# Altium project ShouHuoGui.PrjPCB
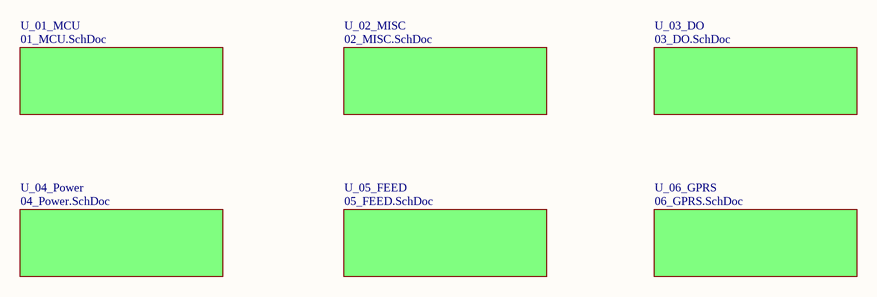
[diagram p0: WRSHG_V1.1.SchDoc]
7 sheets, 395 parts. Net scope: global (net labels, ports and power ports of the same name join across sheets).
Board file: ZhuKong.PcbDoc
Sheets:
  WRSHG_V1.1.SchDoc
    U_01_MCU = 01_MCU.SchDoc
    U_02_MISC = 02_MISC.SchDoc
    U_03_DO = 03_DO.SchDoc
    U_04_Power = 04_Power.SchDoc
    U_05_FEED = 05_FEED.SchDoc
    U_06_GPRS = 06_GPRS.SchDoc

## Sheet WRSHG_V1.1.SchDoc
size A4

### Sub-sheets
U_01_MCU = 01_MCU.SchDoc: no entries
U_02_MISC = 02_MISC.SchDoc: no entries
U_03_DO = 03_DO.SchDoc: no entries
U_04_Power = 04_Power.SchDoc: no entries
U_05_FEED = 05_FEED.SchDoc: no entries
U_06_GPRS = 06_GPRS.SchDoc: no entries

## Sheet 01_MCU.SchDoc
size A3
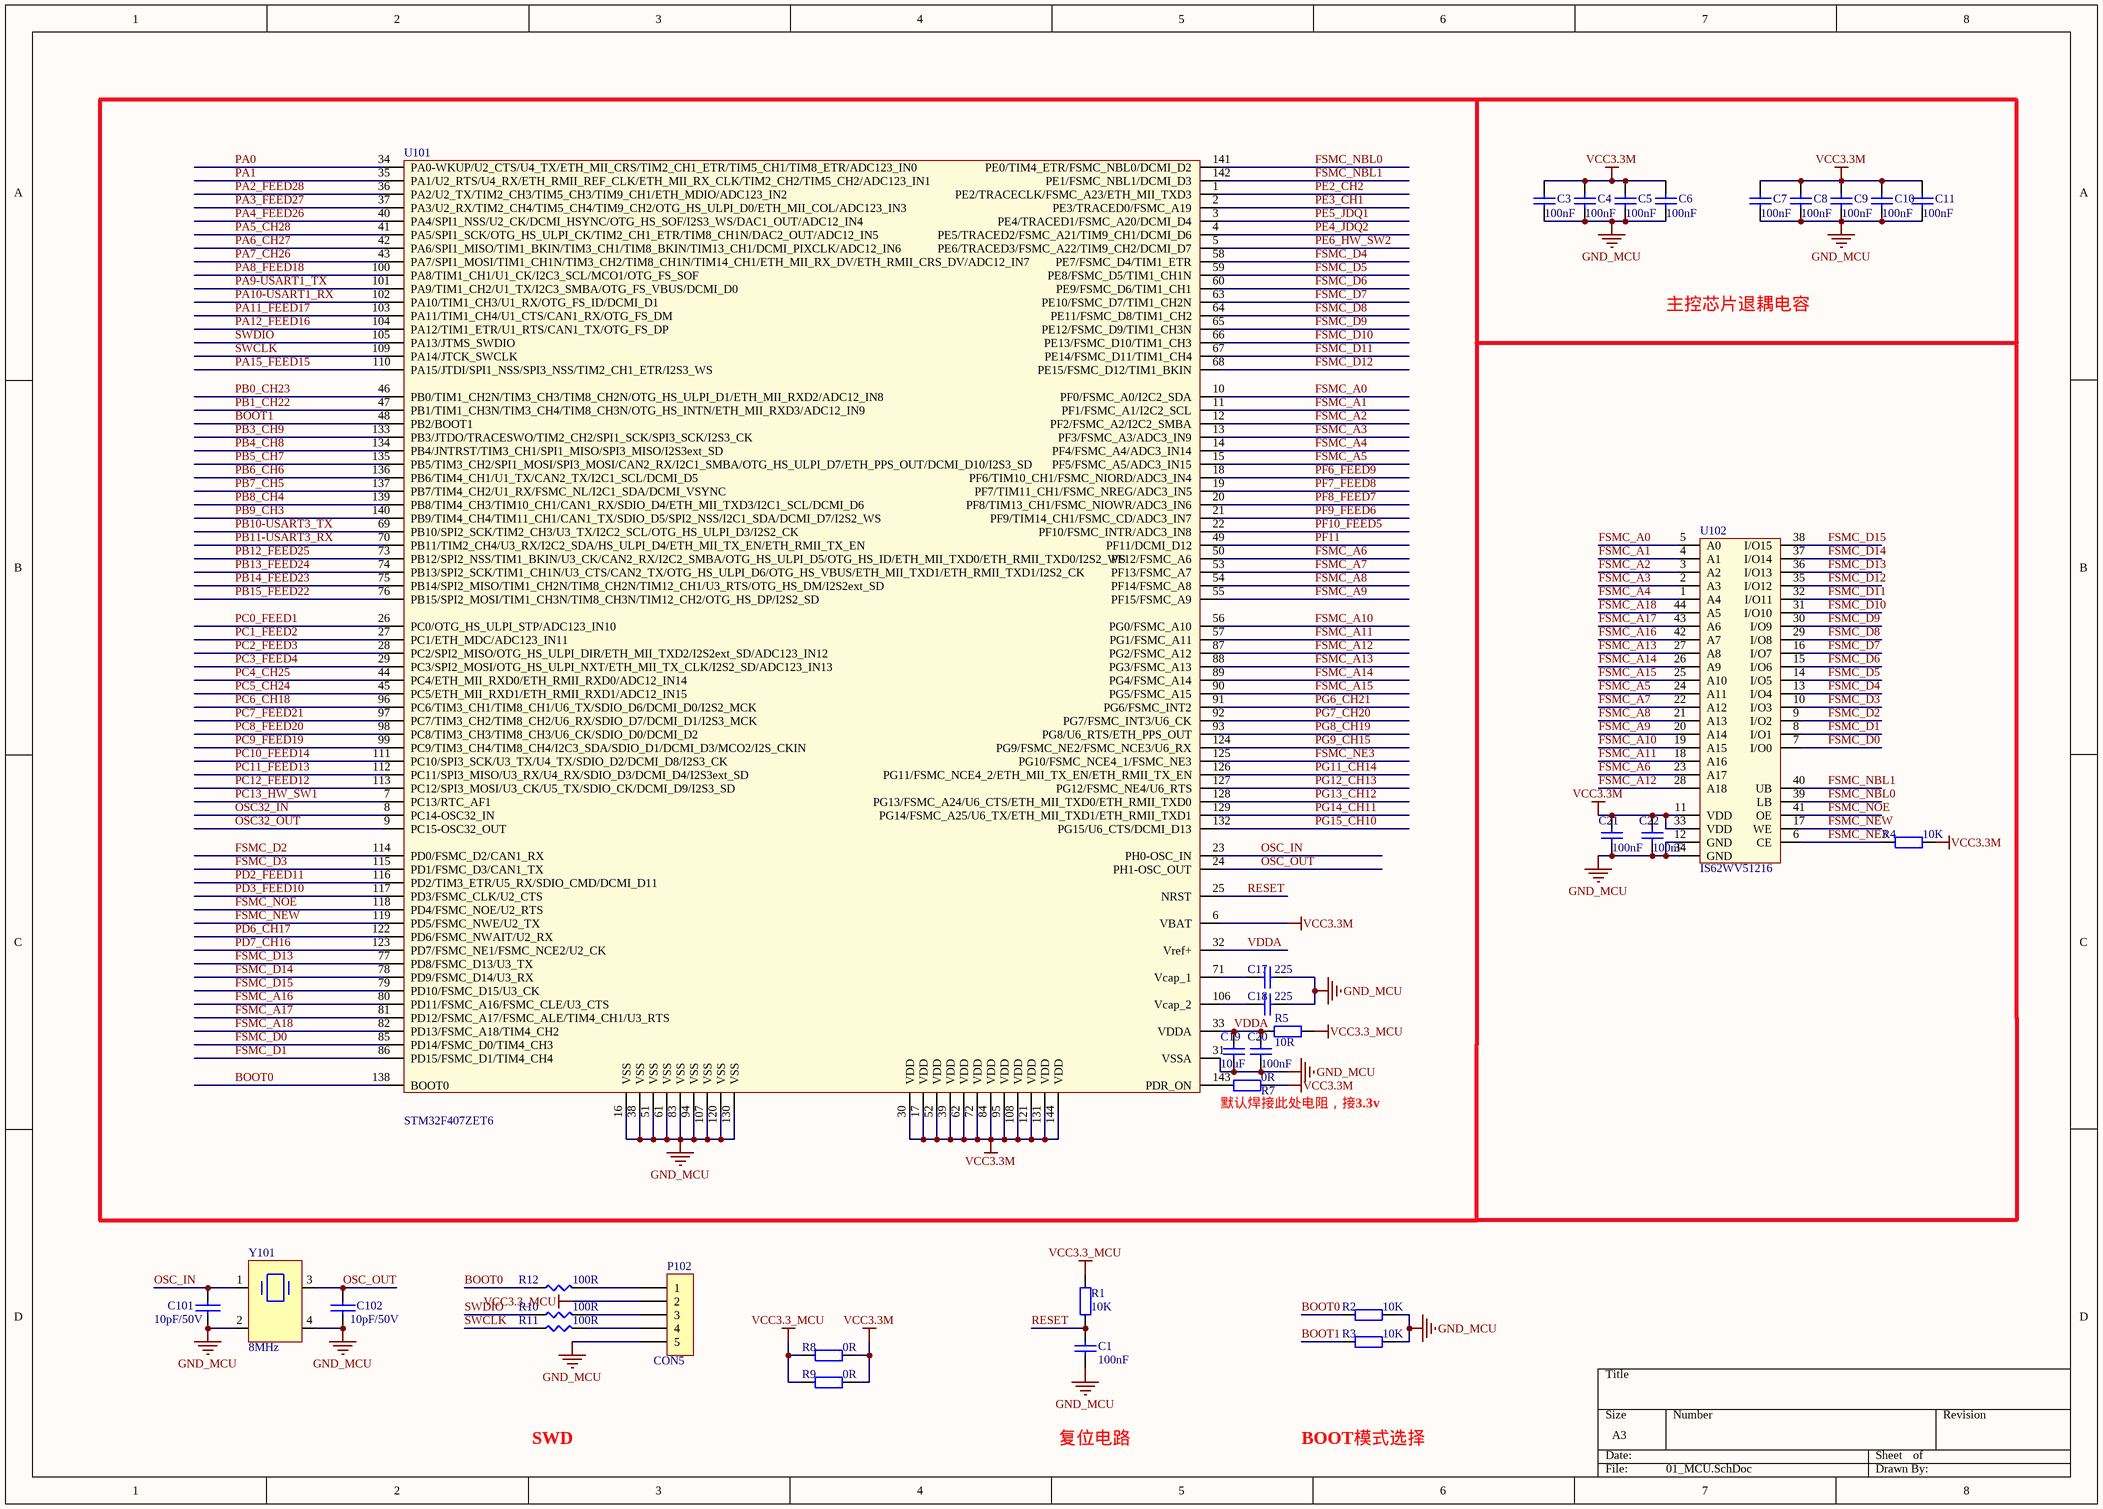
[diagram p1: 01_MCU.SchDoc]

### Parts
C1  100nF  [0603C]
C3  100nF  [0603C]
C4  100nF  [0603C]
C5  100nF  [0603C]
C6  100nF  [0603C]
C7  100nF  [0603C]
C8  100nF  [0603C]
C9  100nF  [0603C]
C10  100nF  [0603C]
C11  100nF  [0603C]
C17  225  [0603C]
C18  225  [0603C]
C19  10uF  [0603C]
C20  100nF  [0603C]
C21  100nF  [LC-0603_R]
C22  100nF  [LC-0603_R]
C101  10pF/50V  [0603C]
C102  10pF/50V  [0603C]
P102  CON5  [SIP5]
R1  10K  [0603R]
R2  10K  [0603R]
R3  10K  [0603R]
R4  10K  [0603R]
R5  10R  [0603R]
R7  0R  [0603R]
R8  0R  [0805R]
R9  0R  [0805R]
R10  100R  [0603R]
R11  100R  [0603R]
R12  100R  [0603R]
U101  STM32F407ZET6  [TQFP144]
U102  IS62WV51216  [TSOP44]
Y101  8MHz  [X_TXCWY]

### Nets
GND_MCU: C1.1 C3.2 C4.2 C5.2 C6.2 C7.2 C8.2 C9.2 C10.2 C11.2 C17.1 C18.1 C19.2 C20.2 C21.2 C22.2 C101.1 C102.1 P102.5 R2.2 R3.2 U101.16(VSS) U101.31(VSSA) U101.38(VSS) U101.51(VSS) U101.61(VSS) U101.83(VSS) U101.94(VSS) U101.107(VSS) U101.120(VSS) U101.130(VSS) U102.12(GND) U102.34(GND) Y101.2 Y101.4
VCC3.3_MCU: P102.2 R1.2 R5.2 R8.1 R9.1
VCC3.3M: C3.1 C4.1 C5.1 C6.1 C7.1 C8.1 C9.1 C10.1 C11.1 C21.1 C22.1 R4.2 R7.2 R8.2 R9.2 U101.6(VBAT) U101.17(VDD) U101.30(VDD) U101.39(VDD) U101.52(VDD) U101.62(VDD) U101.72(VDD) U101.84(VDD) U101.95(VDD) U101.108(VDD) U101.121(VDD) U101.131(VDD) U101.144(VDD) U102.11(VDD) U102.33(VDD)
BOOT0: R2.1 R12.1 U101.138(BOOT0)
BOOT1: R3.1 U101.48(PB2/BOOT1)
FSMC_A0: U101.10(PF0/FSMC_A0/I2C2_SDA) U102.5(A0)
FSMC_A1: U101.11(PF1/FSMC_A1/I2C2_SCL) U102.4(A1)
FSMC_A2: U101.12(PF2/FSMC_A2/I2C2_SMBA) U102.3(A2)
FSMC_A3: U101.13(PF3/FSMC_A3/ADC3_IN9) U102.2(A3)
FSMC_A4: U101.14(PF4/FSMC_A4/ADC3_IN14) U102.1(A4)
FSMC_A5: U101.15(PF5/FSMC_A5/ADC3_IN15) U102.24(A11)
FSMC_A6: U101.50(PF12/FSMC_A6) U102.23(A17)
FSMC_A7: U101.53(PF13/FSMC_A7) U102.22(A12)
FSMC_A8: U101.54(PF14/FSMC_A8) U102.21(A13)
FSMC_A9: U101.55(PF15/FSMC_A9) U102.20(A14)
FSMC_A10: U101.56(PG0/FSMC_A10) U102.19(A15)
FSMC_A11: U101.57(PG1/FSMC_A11) U102.18(A16)
FSMC_A12: U101.87(PG2/FSMC_A12) U102.28(A18)
FSMC_A13: U101.88(PG3/FSMC_A13) U102.27(A8)
FSMC_A14: U101.89(PG4/FSMC_A14) U102.26(A9)
FSMC_A15: U101.90(PG5/FSMC_A15) U102.25(A10)
FSMC_A16: U101.80(PD11/FSMC_A16/FSMC_CLE/U3_CTS) U102.42(A7)
FSMC_A17: U101.81(PD12/FSMC_A17/FSMC_ALE/TIM4_CH1/U3_RTS) U102.43(A6)
FSMC_A18: U101.82(PD13/FSMC_A18/TIM4_CH2) U102.44(A5)
FSMC_D0: U101.85(PD14/FSMC_D0/TIM4_CH3) U102.7(I/O0)
FSMC_D1: U101.86(PD15/FSMC_D1/TIM4_CH4) U102.8(I/O1)
FSMC_D2: U101.114(PD0/FSMC_D2/CAN1_RX) U102.9(I/O2)
FSMC_D3: U101.115(PD1/FSMC_D3/CAN1_TX) U102.10(I/O3)
FSMC_D4: U101.58(PE7/FSMC_D4/TIM1_ETR) U102.13(I/O4)
FSMC_D5: U101.59(PE8/FSMC_D5/TIM1_CH1N) U102.14(I/O5)
FSMC_D6: U101.60(PE9/FSMC_D6/TIM1_CH1) U102.15(I/O6)
FSMC_D7: U101.63(PE10/FSMC_D7/TIM1_CH2N) U102.16(I/O7)
FSMC_D8: U101.64(PE11/FSMC_D8/TIM1_CH2) U102.29(I/O8)
FSMC_D9: U101.65(PE12/FSMC_D9/TIM1_CH3N) U102.30(I/O9)
FSMC_D10: U101.66(PE13/FSMC_D10/TIM1_CH3) U102.31(I/O10)
FSMC_D11: U101.67(PE14/FSMC_D11/TIM1_CH4) U102.32(I/O11)
FSMC_D12: U101.68(PE15/FSMC_D12/TIM1_BKIN) U102.35(I/O12)
FSMC_D13: U101.77(PD8/FSMC_D13/U3_TX) U102.36(I/O13)
FSMC_D14: U101.78(PD9/FSMC_D14/U3_RX) U102.37(I/O14)
FSMC_D15: U101.79(PD10/FSMC_D15/U3_CK) U102.38(I/O15)
FSMC_NBL0: U101.141(PE0/TIM4_ETR/FSMC_NBL0/DCMI_D2) U102.39(LB)
FSMC_NBL1: U101.142(PE1/FSMC_NBL1/DCMI_D3) U102.40(UB)
FSMC_NE3: R4.1 U101.125(PG10/FSMC_NCE4_1/FSMC_NE3) U102.6(CE)
FSMC_NEW: U101.119(PD5/FSMC_NWE/U2_TX) U102.17(WE)
FSMC_NOE: U101.118(PD4/FSMC_NOE/U2_RTS) U102.41(OE)
OSC32_IN: U101.8(PC14-OSC32_IN)
OSC32_OUT: U101.9(PC15-OSC32_OUT)
OSC_IN: C101.2 U101.23(PH0-OSC_IN) Y101.1
OSC_OUT: C102.2 U101.24(PH1-OSC_OUT) Y101.3
PA0: U101.34(PA0-WKUP/U2_CTS/U4_TX/ETH_MII_CRS/TIM2_CH1_ETR/TIM5_CH1/TIM8_ETR/ADC123_IN0)
PA1: U101.35(PA1/U2_RTS/U4_RX/ETH_RMII_REF_CLK/ETH_MII_RX_CLK/TIM2_CH2/TIM5_CH2/ADC123_IN1)
PA2_FEED28: U101.36(PA2/U2_TX/TIM2_CH3/TIM5_CH3/TIM9_CH1/ETH_MDIO/ADC123_IN2)
PA3_FEED27: U101.37(PA3/U2_RX/TIM2_CH4/TIM5_CH4/TIM9_CH2/OTG_HS_ULPI_D0/ETH_MII_COL/ADC123_IN3)
PA4_FEED26: U101.40(PA4/SPI1_NSS/U2_CK/DCMI_HSYNC/OTG_HS_SOF/I2S3_WS/DAC1_OUT/ADC12_IN4)
PA5_CH28: U101.41(PA5/SPI1_SCK/OTG_HS_ULPI_CK/TIM2_CH1_ETR/TIM8_CH1N/DAC2_OUT/ADC12_IN5)
PA6_CH27: U101.42(PA6/SPI1_MISO/TIM1_BKIN/TIM3_CH1/TIM8_BKIN/TIM13_CH1/DCMI_PIXCLK/ADC12_IN6)
PA7_CH26: U101.43(PA7/SPI1_MOSI/TIM1_CH1N/TIM3_CH2/TIM8_CH1N/TIM14_CH1/ETH_MII_RX_DV/ETH_RMII_CRS_DV/ADC12_IN7)
PA8_FEED18: U101.100(PA8/TIM1_CH1/U1_CK/I2C3_SCL/MCO1/OTG_FS_SOF)
PA9-USART1_TX: U101.101(PA9/TIM1_CH2/U1_TX/I2C3_SMBA/OTG_FS_VBUS/DCMI_D0)
PA10-USART1_RX: U101.102(PA10/TIM1_CH3/U1_RX/OTG_FS_ID/DCMI_D1)
PA11_FEED17: U101.103(PA11/TIM1_CH4/U1_CTS/CAN1_RX/OTG_FS_DM)
PA12_FEED16: U101.104(PA12/TIM1_ETR/U1_RTS/CAN1_TX/OTG_FS_DP)
PA15_FEED15: U101.110(PA15/JTDI/SPI1_NSS/SPI3_NSS/TIM2_CH1_ETR/I2S3_WS)
PB0_CH23: U101.46(PB0/TIM1_CH2N/TIM3_CH3/TIM8_CH2N/OTG_HS_ULPI_D1/ETH_MII_RXD2/ADC12_IN8)
PB1_CH22: U101.47(PB1/TIM1_CH3N/TIM3_CH4/TIM8_CH3N/OTG_HS_INTN/ETH_MII_RXD3/ADC12_IN9)
PB3_CH9: U101.133(PB3/JTDO/TRACESWO/TIM2_CH2/SPI1_SCK/SPI3_SCK/I2S3_CK)
PB4_CH8: U101.134(PB4/JNTRST/TIM3_CH1/SPI1_MISO/SPI3_MISO/I2S3ext_SD)
PB5_CH7: U101.135(PB5/TIM3_CH2/SPI1_MOSI/SPI3_MOSI/CAN2_RX/I2C1_SMBA/OTG_HS_ULPI_D7/ETH_PPS_OUT/DCMI_D10/I2S3_SD)
PB6_CH6: U101.136(PB6/TIM4_CH1/U1_TX/CAN2_TX/I2C1_SCL/DCMI_D5)
PB7_CH5: U101.137(PB7/TIM4_CH2/U1_RX/FSMC_NL/I2C1_SDA/DCMI_VSYNC)
PB8_CH4: U101.139(PB8/TIM4_CH3/TIM10_CH1/CAN1_RX/SDIO_D4/ETH_MII_TXD3/I2C1_SCL/DCMI_D6)
PB9_CH3: U101.140(PB9/TIM4_CH4/TIM11_CH1/CAN1_TX/SDIO_D5/SPI2_NSS/I2C1_SDA/DCMI_D7/I2S2_WS)
PB10-USART3_TX: U101.69(PB10/SPI2_SCK/TIM2_CH3/U3_TX/I2C2_SCL/OTG_HS_ULPI_D3/I2S2_CK)
PB11-USART3_RX: U101.70(PB11/TIM2_CH4/U3_RX/I2C2_SDA/HS_ULPI_D4/ETH_MII_TX_EN/ETH_RMII_TX_EN)
PB12_FEED25: U101.73(PB12/SPI2_NSS/TIM1_BKIN/U3_CK/CAN2_RX/I2C2_SMBA/OTG_HS_ULPI_D5/OTG_HS_ID/ETH_MII_TXD0/ETH_RMII_TXD0/I2S2_WS)
PB13_FEED24: U101.74(PB13/SPI2_SCK/TIM1_CH1N/U3_CTS/CAN2_TX/OTG_HS_ULPI_D6/OTG_HS_VBUS/ETH_MII_TXD1/ETH_RMII_TXD1/I2S2_CK)
PB14_FEED23: U101.75(PB14/SPI2_MISO/TIM1_CH2N/TIM8_CH2N/TIM12_CH1/U3_RTS/OTG_HS_DM/I2S2ext_SD)
PB15_FEED22: U101.76(PB15/SPI2_MOSI/TIM1_CH3N/TIM8_CH3N/TIM12_CH2/OTG_HS_DP/I2S2_SD)
PC0_FEED1: U101.26(PC0/OTG_HS_ULPI_STP/ADC123_IN10)
PC1_FEED2: U101.27(PC1/ETH_MDC/ADC123_IN11)
PC2_FEED3: U101.28(PC2/SPI2_MISO/OTG_HS_ULPI_DIR/ETH_MII_TXD2/I2S2ext_SD/ADC123_IN12)
PC3_FEED4: U101.29(PC3/SPI2_MOSI/OTG_HS_ULPI_NXT/ETH_MII_TX_CLK/I2S2_SD/ADC123_IN13)
PC4_CH25: U101.44(PC4/ETH_MII_RXD0/ETH_RMII_RXD0/ADC12_IN14)
PC5_CH24: U101.45(PC5/ETH_MII_RXD1/ETH_RMII_RXD1/ADC12_IN15)
PC6_CH18: U101.96(PC6/TIM3_CH1/TIM8_CH1/U6_TX/SDIO_D6/DCMI_D0/I2S2_MCK)
PC7_FEED21: U101.97(PC7/TIM3_CH2/TIM8_CH2/U6_RX/SDIO_D7/DCMI_D1/I2S3_MCK)
PC8_FEED20: U101.98(PC8/TIM3_CH3/TIM8_CH3/U6_CK/SDIO_D0/DCMI_D2)
PC9_FEED19: U101.99(PC9/TIM3_CH4/TIM8_CH4/I2C3_SDA/SDIO_D1/DCMI_D3/MCO2/I2S_CKIN)
PC10_FEED14: U101.111(PC10/SPI3_SCK/U3_TX/U4_TX/SDIO_D2/DCMI_D8/I2S3_CK)
PC11_FEED13: U101.112(PC11/SPI3_MISO/U3_RX/U4_RX/SDIO_D3/DCMI_D4/I2S3ext_SD)
PC12_FEED12: U101.113(PC12/SPI3_MOSI/U3_CK/U5_TX/SDIO_CK/DCMI_D9/I2S3_SD)
PC13_HW_SW1: U101.7(PC13/RTC_AF1)
PD2_FEED11: U101.116(PD2/TIM3_ETR/U5_RX/SDIO_CMD/DCMI_D11)
PD3_FEED10: U101.117(PD3/FSMC_CLK/U2_CTS)
PD6_CH17: U101.122(PD6/FSMC_NWAIT/U2_RX)
PD7_CH16: U101.123(PD7/FSMC_NE1/FSMC_NCE2/U2_CK)
PE2_CH2: U101.1(PE2/TRACECLK/FSMC_A23/ETH_MII_TXD3)
PE3_CH1: U101.2(PE3/TRACED0/FSMC_A19)
PE4_JDQ2: U101.4(PE5/TRACED2/FSMC_A21/TIM9_CH1/DCMI_D6)
PE5_JDQ1: U101.3(PE4/TRACED1/FSMC_A20/DCMI_D4)
PE6_HW_SW2: U101.5(PE6/TRACED3/FSMC_A22/TIM9_CH2/DCMI_D7)
PF6_FEED9: U101.18(PF6/TIM10_CH1/FSMC_NIORD/ADC3_IN4)
PF7_FEED8: U101.19(PF7/TIM11_CH1/FSMC_NREG/ADC3_IN5)
PF8_FEED7: U101.20(PF8/TIM13_CH1/FSMC_NIOWR/ADC3_IN6)
PF9_FEED6: U101.21(PF9/TIM14_CH1/FSMC_CD/ADC3_IN7)
PF10_FEED5: U101.22(PF10/FSMC_INTR/ADC3_IN8)
PF11: U101.49(PF11/DCMI_D12)
PG6_CH21: U101.91(PG6/FSMC_INT2)
PG7_CH20: U101.92(PG7/FSMC_INT3/U6_CK)
PG8_CH19: U101.93(PG8/U6_RTS/ETH_PPS_OUT)
PG9_CH15: U101.124(PG9/FSMC_NE2/FSMC_NCE3/U6_RX)
PG11_CH14: U101.126(PG11/FSMC_NCE4_2/ETH_MII_TX_EN/ETH_RMII_TX_EN)
PG12_CH13: U101.127(PG12/FSMC_NE4/U6_RTS)
PG13_CH12: U101.128(PG13/FSMC_A24/U6_CTS/ETH_MII_TXD0/ETH_RMII_TXD0)
PG14_CH11: U101.129(PG14/FSMC_A25/U6_TX/ETH_MII_TXD1/ETH_RMII_TXD1)
PG15_CH10: U101.132(PG15/U6_CTS/DCMI_D13)
RESET: C1.2 R1.1 U101.25(NRST)
SWCLK: R11.1 U101.109(PA14/JTCK_SWCLK)
SWDIO: R10.1 U101.105(PA13/JTMS_SWDIO)
VDDA: C19.1 C20.1 R5.1 U101.32(Vref+) U101.33(VDDA)
NetC17_2: C17.2 U101.71(Vcap_1)
NetC18_2: C18.2 U101.106(Vcap_2)
NetP102_1: P102.1 R12.2
NetP102_3: P102.3 R10.2
NetP102_4: P102.4 R11.2
NetR7_1: R7.1 U101.143(PDR_ON)

### Notes on the sheet
- 主控芯片退耦电容
- 默认焊接此处电阻，接3.3v
- SWD
- 复位电路
- BOOT模式选择

### Library data of the parts
C1 C3-C11 C17-C22 = Cap: 无极性电容; Published: 8-Jun-2000; LatestRevisionDate: 17-Jul-2002; LatestRevisionNote: Re-released for DXP Platform.; PackageReference: RAD-0.3; Publisher: Altium Limited
C101 C102 = CAP: Capacitor
P102 = CON5: Connector
R1-R5 R7-R9 = 0603 2.7KΩ (2701) 1%: 贴片电阻; ComponentLink1Description: 供应商链接; ComponentLink1URL: http://www.szlcsc.com/product/details_13814.html; Package: 0603; Supplier: LC; SuppliersPartNumber: C13167
R10-R12 = 0603R
Y101 = SMD3225

## Sheet 02_MISC.SchDoc
size A3
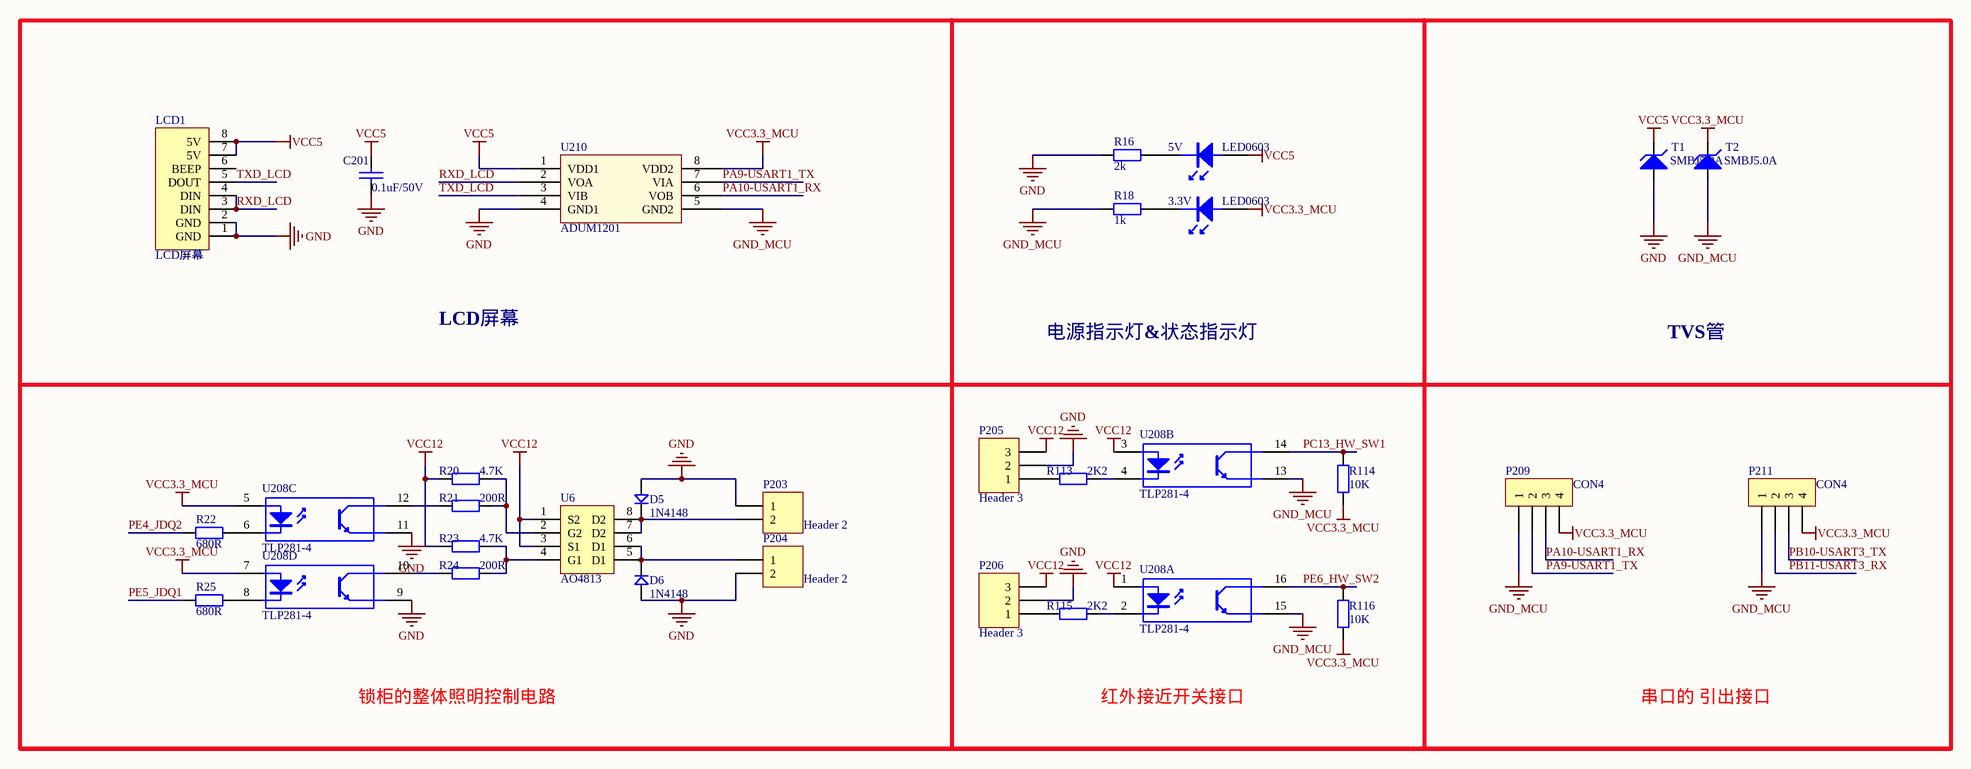
[diagram p2: 02_MISC.SchDoc]

### Parts
3.3V  LED0603  [0603LED]
5V  LED0603  [0603LED]
C201  0.1uF/50V  [0805C]
D5  1N4148  [D1812]
D6  1N4148  [D1812]
LCD1  LCD屏幕  [lcd_JIEKOU]
P203  Header 2  [HEAD2L-0.8]
P204  Header 2  [HEAD2L-0.8]
P205  Header 3  [HDR1X3]
P206  Header 3  [HDR1X3]
P209  CON4  [SIP4]
P211  CON4  [SIP4]
R16  2k  [0603R]
R18  1k  [0603R]
R20  4.7K  [0603R]
R21  200R  [0603R]
R22  680R  [0603R]
R23  4.7K  [0603R]
R24  200R  [0603R]
R25  680R  [0603R]
R113  2K2  [0603R]
R114  10K  [0603R]
R115  2K2  [0603R]
R116  10K  [0603R]
T1  SMBJ5.0A  [D1812]
T2  SMBJ5.0A  [D1812]
U6  AO4813  [SO-8]
U208  TLP281-4  [SO-16]  (parts A,B,C,D of 4)
U210  ADUM1201  [SOP_8]

### Nets
GND: C201.2 D5.1 D6.1 LCD1.1(GND) LCD1.2(GND) P203.1 P204.2 P205.2 P206.2 R16.1 T1.1(A) U208.9(E) U208.11(E) U210.4(GND1)
GND_MCU: P209.1 P211.1 R18.1 T2.1(A) U208.13(E) U208.15(E) U210.5(GND2)
VCC3.3_MCU: 3.3V.2(+) P209.4 P211.4 R114.1 R116.1 T2.2(K) U208.5(A) U208.7(A) U210.8(VDD2)
VCC5: 5V.2(+) C201.1 LCD1.7(5V) LCD1.8(5V) T1.2(K) U210.1(VDD1)
VCC12: P205.3 P206.3 R20.2 R23.2 U6.1(S2) U6.3(S1) U208.1(A) U208.3(A)
PA9-USART1_TX: P209.2 U210.7(VIA)
PA10-USART1_RX: P209.3 U210.6(VOB)
PB10-USART3_TX: P211.3
PB11-USART3_RX: P211.2
PC13_HW_SW1: R114.2 U208.14(C)
PE4_JDQ2: R22.1
PE5_JDQ1: R25.1
PE6_HW_SW2: R116.2 U208.16(C)
RXD_LCD: LCD1.3(DIN) LCD1.4(DIN) U210.2(VOA)
TXD_LCD: LCD1.5(DOUT) U210.3(VIB)
Net3.3V_1: 3.3V.1(-) R18.2
Net5V_1: 5V.1(-) R16.2
NetD5_2: D5.2 P203.2 U6.7(D2) U6.8(D2)
NetD6_2: D6.2 P204.1 U6.5(D1) U6.6(D1)
NetP205_1: P205.1 R113.1
NetP206_1: P206.1 R115.1
NetR20_1: R20.1 R21.2 U6.2(G2)
NetR21_1: R21.1 U208.12(C)
NetR22_2: R22.2 U208.6(K)
NetR23_1: R23.1 R24.2 U6.4(G1)
NetR24_1: R24.1 U208.10(C)
NetR25_2: R25.2 U208.8(K)
NetR113_2: R113.2 U208.4(K)
NetR115_2: R115.2 U208.2(K)

Not connected (* = marked no-connect by the designer): LCD1 6(BEEP)

### Notes on the sheet
- LCD屏幕
- 电源指示灯&状态指示灯
- TVS管
- 锁柜的整体照明控制电路
- 红外接近开关接口
- 串口的 引出接口

### Library data of the parts
3.3V 5V = LED_SMD: 贴片LED
C201 = CAP: Capacitor
D5 D6 = D
LCD1 = Component_1
P203 P204 = Header 2: Header, 2-Pin; LatestRevisionDate: 17-Jul-2002; LatestRevisionNote: Re-released for DXP Platform.; Publisher: Altium Limited
P205 P206 = Header 3: Header, 3-Pin; LatestRevisionDate: 17-Jul-2002; LatestRevisionNote: Re-released for DXP Platform.; Publisher: Altium Limited
P209 P211 = CON4: Connector
R16 = Res1: 贴片电阻; Value: 1K; Published: 8-Jun-2000; LatestRevisionDate: 17-Jul-2002; LatestRevisionNote: Re-released for DXP Platform.; PackageReference: AXIAL-0.4; Publisher: Altium Limited
R18 = Res1: 贴片电阻; Published: 8-Jun-2000; LatestRevisionDate: 17-Jul-2002; LatestRevisionNote: Re-released for DXP Platform.; PackageReference: AXIAL-0.4; Publisher: Altium Limited; Value: 1K
R20-R25 R113-R116 = 0603 2.7KΩ (2701) 1%: 贴片电阻; ComponentLink1Description: 供应商链接; ComponentLink1URL: http://www.szlcsc.com/product/details_13814.html; Package: 0603; Supplier: LC; SuppliersPartNumber: C13167
T1 T2 = SS36: Zener Diode
U6 = NDS8434
U208 = TP521-4_1
U210 = ADUM1201: 串口隔离

## Sheet 03_DO.SchDoc
size 444 x 254 mm
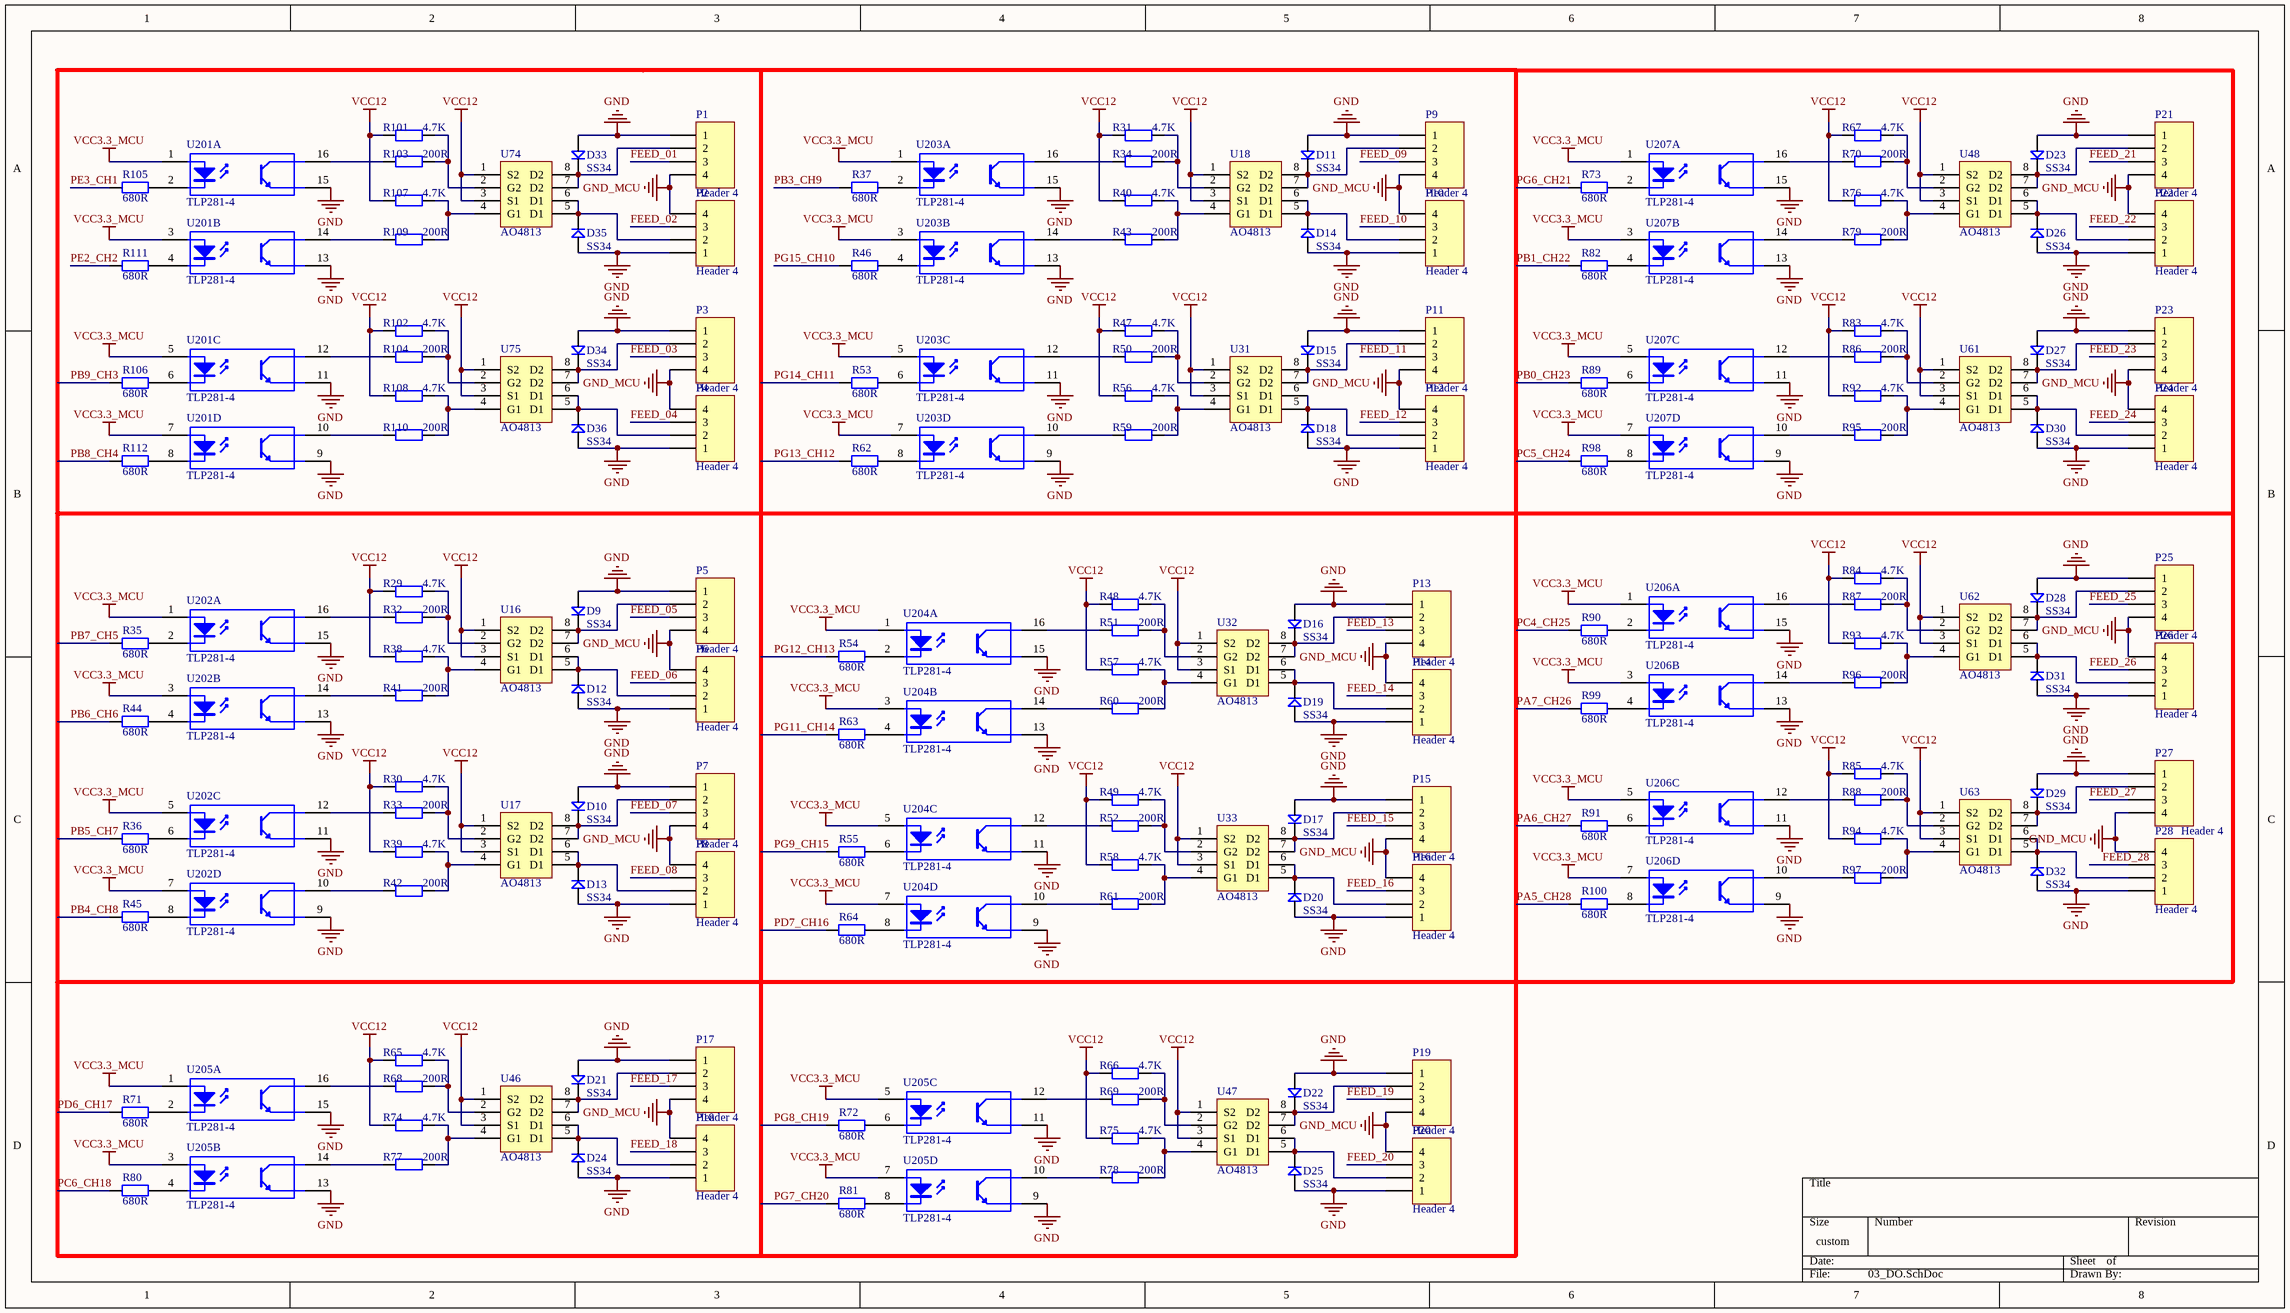
[diagram p3: 03_DO.SchDoc]

### Parts
D9  SS34  [D1812]
D10  SS34  [D1812]
D11  SS34  [D1812]
D12  SS34  [D1812]
D13  SS34  [D1812]
D14  SS34  [D1812]
D15  SS34  [D1812]
D16  SS34  [D1812]
D17  SS34  [D1812]
D18  SS34  [D1812]
D19  SS34  [D1812]
D20  SS34  [D1812]
D21  SS34  [D1812]
D22  SS34  [D1812]
D23  SS34  [D1812]
D24  SS34  [D1812]
D25  SS34  [D1812]
D26  SS34  [D1812]
D27  SS34  [D1812]
D28  SS34  [D1812]
D29  SS34  [D1812]
D30  SS34  [D1812]
D31  SS34  [D1812]
D32  SS34  [D1812]
D33  SS34  [D1812]
D34  SS34  [D1812]
D35  SS34  [D1812]
D36  SS34  [D1812]
P1  Header 4  [XH2.54-1*10]
P2  Header 4  [XH2.54-1*10]
P3  Header 4  [XH2.54-1*10]
P4  Header 4  [XH2.54-1*10]
P5  Header 4  [XH2.54-1*10]
P6  Header 4  [XH2.54-1*10]
P7  Header 4  [XH2.54-1*10]
P8  Header 4  [XH2.54-1*10]
P9  Header 4  [XH2.54-1*10]
P10  Header 4  [XH2.54-1*10]
P11  Header 4  [XH2.54-1*10]
P12  Header 4  [XH2.54-1*10]
P13  Header 4  [XH2.54-1*10]
P14  Header 4  [XH2.54-1*10]
P15  Header 4  [XH2.54-1*10]
P16  Header 4  [XH2.54-1*10]
P17  Header 4  [XH2.54-1*10]
P18  Header 4  [XH2.54-1*10]
P19  Header 4  [XH2.54-1*10]
P20  Header 4  [XH2.54-1*10]
P21  Header 4  [XH2.54-1*10]
P22  Header 4  [XH2.54-1*10]
P23  Header 4  [XH2.54-1*10]
P24  Header 4  [XH2.54-1*10]
P25  Header 4  [XH2.54-1*10]
P26  Header 4  [XH2.54-1*10]
P27  Header 4  [XH2.54-1*10]
P28  Header 4  [XH2.54-1*10]
R29  4.7K  [0603R]
R30  4.7K  [0603R]
R31  4.7K  [0603R]
R32  200R  [0603R]
R33  200R  [0603R]
R34  200R  [0603R]
R35  680R  [0603R]
R36  680R  [0603R]
R37  680R  [0603R]
R38  4.7K  [0603R]
R39  4.7K  [0603R]
R40  4.7K  [0603R]
R41  200R  [0603R]
R42  200R  [0603R]
R43  200R  [0603R]
R44  680R  [0603R]
R45  680R  [0603R]
R46  680R  [0603R]
R47  4.7K  [0603R]
R48  4.7K  [0603R]
R49  4.7K  [0603R]
R50  200R  [0603R]
R51  200R  [0603R]
R52  200R  [0603R]
R53  680R  [0603R]
R54  680R  [0603R]
R55  680R  [0603R]
R56  4.7K  [0603R]
R57  4.7K  [0603R]
R58  4.7K  [0603R]
R59  200R  [0603R]
R60  200R  [0603R]
R61  200R  [0603R]
R62  680R  [0603R]
R63  680R  [0603R]
R64  680R  [0603R]
R65  4.7K  [0603R]
R66  4.7K  [0603R]
R67  4.7K  [0603R]
R68  200R  [0603R]
R69  200R  [0603R]
R70  200R  [0603R]
R71  680R  [0603R]
R72  680R  [0603R]
R73  680R  [0603R]
R74  4.7K  [0603R]
R75  4.7K  [0603R]
R76  4.7K  [0603R]
R77  200R  [0603R]
R78  200R  [0603R]
R79  200R  [0603R]
R80  680R  [0603R]
R81  680R  [0603R]
R82  680R  [0603R]
R83  4.7K  [0603R]
R84  4.7K  [0603R]
R85  4.7K  [0603R]
R86  200R  [0603R]
R87  200R  [0603R]
R88  200R  [0603R]
R89  680R  [0603R]
R90  680R  [0603R]
R91  680R  [0603R]
R92  4.7K  [0603R]
R93  4.7K  [0603R]
R94  4.7K  [0603R]
R95  200R  [0603R]
R96  200R  [0603R]
R97  200R  [0603R]
R98  680R  [0603R]
R99  680R  [0603R]
R100  680R  [0603R]
R101  4.7K  [0603R]
R102  4.7K  [0603R]
R103  200R  [0603R]
R104  200R  [0603R]
R105  680R  [0603R]
R106  680R  [0603R]
R107  4.7K  [0603R]
R108  4.7K  [0603R]
R109  200R  [0603R]
R110  200R  [0603R]
R111  680R  [0603R]
R112  680R  [0603R]
U16  AO4813  [SO-8]
U17  AO4813  [SO-8]
U18  AO4813  [SO-8]
U31  AO4813  [SO-8]
U32  AO4813  [SO-8]
U33  AO4813  [SO-8]
U46  AO4813  [SO-8]
U47  AO4813  [SO-8]
U48  AO4813  [SO-8]
U61  AO4813  [SO-8]
U62  AO4813  [SO-8]
U63  AO4813  [SO-8]
U74  AO4813  [SO-8]
U75  AO4813  [SO-8]
U201  TLP281-4  [SO-16]  (parts A,B,C,D of 4)
U202  TLP281-4  [SO-16]  (parts A,B,C,D of 4)
U203  TLP281-4  [SO-16]  (parts A,B,C,D of 4)
U204  TLP281-4  [SO-16]  (parts A,B,C,D of 4)
U205  TLP281-4  [SO-16]  (parts A,B,C,D of 4)
U206  TLP281-4  [SO-16]  (parts A,B,C,D of 4)
U207  TLP281-4  [SO-16]  (parts A,B,C,D of 4)

### Nets
GND: D9.1 D10.1 D11.1 D12.1 D13.1 D14.1 D15.1 D16.1 D17.1 D18.1 D19.1 D20.1 D21.1 D22.1 D23.1 D24.1 D25.1 D26.1 D27.1 D28.1 D29.1 D30.1 D31.1 D32.1 D33.1 D34.1 D35.1 D36.1 P1.1 P2.1 P3.1 P4.1 P5.1 P6.1 P7.1 P8.1 P9.1 P10.1 P11.1 P12.1 P13.1 P14.1 P15.1 P16.1 P17.1 P18.1 P19.1 P20.1 P21.1 P22.1 P23.1 P24.1 P25.1 P26.1 P27.1 P28.1 U201.9(E) U201.11(E) U201.13(E) U201.15(E) U202.9(E) U202.11(E) U202.13(E) U202.15(E) U203.9(E) U203.11(E) U203.13(E) U203.15(E) U204.9(E) U204.11(E) U204.13(E) U204.15(E) U205.9(E) U205.11(E) U205.13(E) U205.15(E) U206.9(E) U206.11(E) U206.13(E) U206.15(E) U207.9(E) U207.11(E) U207.13(E) U207.15(E)
GND_MCU: P1.4 P2.4 P3.4 P4.4 P5.4 P6.4 P7.4 P8.4 P9.4 P10.4 P11.4 P12.4 P13.4 P14.4 P15.4 P16.4 P17.4 P18.4 P19.4 P20.4 P21.4 P22.4 P23.4 P24.4 P25.4 P26.4 P27.4 P28.4
VCC3.3_MCU: U201.1(A) U201.3(A) U201.5(A) U201.7(A) U202.1(A) U202.3(A) U202.5(A) U202.7(A) U203.1(A) U203.3(A) U203.5(A) U203.7(A) U204.1(A) U204.3(A) U204.5(A) U204.7(A) U205.1(A) U205.3(A) U205.5(A) U205.7(A) U206.1(A) U206.3(A) U206.5(A) U206.7(A) U207.1(A) U207.3(A) U207.5(A) U207.7(A)
VCC12: R29.2 R30.2 R31.2 R38.2 R39.2 R40.2 R47.2 R48.2 R49.2 R56.2 R57.2 R58.2 R65.2 R66.2 R67.2 R74.2 R75.2 R76.2 R83.2 R84.2 R85.2 R92.2 R93.2 R94.2 R101.2 R102.2 R107.2 R108.2 U16.1(S2) U16.3(S1) U17.1(S2) U17.3(S1) U18.1(S2) U18.3(S1) U31.1(S2) U31.3(S1) U32.1(S2) U32.3(S1) U33.1(S2) U33.3(S1) U46.1(S2) U46.3(S1) U47.1(S2) U47.3(S1) U48.1(S2) U48.3(S1) U61.1(S2) U61.3(S1) U62.1(S2) U62.3(S1) U63.1(S2) U63.3(S1) U74.1(S2) U74.3(S1) U75.1(S2) U75.3(S1)
FEED_01: P1.3
FEED_02: P2.3
FEED_03: P3.3
FEED_04: P4.3
FEED_05: P5.3
FEED_06: P6.3
FEED_07: P7.3
FEED_08: P8.3
FEED_09: P9.3
FEED_10: P10.3
FEED_11: P11.3
FEED_12: P12.3
FEED_13: P13.3
FEED_14: P14.3
FEED_15: P15.3
FEED_16: P16.3
FEED_17: P17.3
FEED_18: P18.3
FEED_19: P19.3
FEED_20: P20.3
FEED_21: P21.3
FEED_22: P22.3
FEED_23: P23.3
FEED_24: P24.3
FEED_25: P25.3
FEED_26: P26.3
FEED_27: P27.3
FEED_28: P28.3
PA5_CH28: R100.1
PA6_CH27: R91.1
PA7_CH26: R99.1
PB0_CH23: R89.1
PB1_CH22: R82.1
PB3_CH9: R37.1
PB4_CH8: R45.1
PB5_CH7: R36.1
PB6_CH6: R44.1
PB7_CH5: R35.1
PB8_CH4: R112.1
PB9_CH3: R106.1
PC4_CH25: R90.1
PC5_CH24: R98.1
PC6_CH18: R80.1
PD6_CH17: R71.1
PD7_CH16: R64.1
PE2_CH2: R111.1
PE3_CH1: R105.1
PG6_CH21: R73.1
PG7_CH20: R81.1
PG8_CH19: R72.1
PG9_CH15: R55.1
PG11_CH14: R63.1
PG12_CH13: R54.1
PG13_CH12: R62.1
PG14_CH11: R53.1
PG15_CH10: R46.1
NetD9_2: D9.2 P5.2 U16.7(D2) U16.8(D2)
NetD10_2: D10.2 P7.2 U17.7(D2) U17.8(D2)
NetD11_2: D11.2 P9.2 U18.7(D2) U18.8(D2)
NetD12_2: D12.2 P6.2 U16.5(D1) U16.6(D1)
NetD13_2: D13.2 P8.2 U17.5(D1) U17.6(D1)
NetD14_2: D14.2 P10.2 U18.5(D1) U18.6(D1)
NetD15_2: D15.2 P11.2 U31.7(D2) U31.8(D2)
NetD16_2: D16.2 P13.2 U32.7(D2) U32.8(D2)
NetD17_2: D17.2 P15.2 U33.7(D2) U33.8(D2)
NetD18_2: D18.2 P12.2 U31.5(D1) U31.6(D1)
NetD19_2: D19.2 P14.2 U32.5(D1) U32.6(D1)
NetD20_2: D20.2 P16.2 U33.5(D1) U33.6(D1)
NetD21_2: D21.2 P17.2 U46.7(D2) U46.8(D2)
NetD22_2: D22.2 P19.2 U47.7(D2) U47.8(D2)
NetD23_2: D23.2 P21.2 U48.7(D2) U48.8(D2)
NetD24_2: D24.2 P18.2 U46.5(D1) U46.6(D1)
NetD25_2: D25.2 P20.2 U47.5(D1) U47.6(D1)
NetD26_2: D26.2 P22.2 U48.5(D1) U48.6(D1)
NetD27_2: D27.2 P23.2 U61.7(D2) U61.8(D2)
NetD28_2: D28.2 P25.2 U62.7(D2) U62.8(D2)
NetD29_2: D29.2 P27.2 U63.7(D2) U63.8(D2)
NetD30_2: D30.2 P24.2 U61.5(D1) U61.6(D1)
NetD31_2: D31.2 P26.2 U62.5(D1) U62.6(D1)
NetD32_2: D32.2 P28.2 U63.5(D1) U63.6(D1)
NetD33_2: D33.2 P1.2 U74.7(D2) U74.8(D2)
NetD34_2: D34.2 P3.2 U75.7(D2) U75.8(D2)
NetD35_2: D35.2 P2.2 U74.5(D1) U74.6(D1)
NetD36_2: D36.2 P4.2 U75.5(D1) U75.6(D1)
NetR29_1: R29.1 R32.2 U16.2(G2)
NetR30_1: R30.1 R33.2 U17.2(G2)
NetR31_1: R31.1 R34.2 U18.2(G2)
NetR32_1: R32.1 U202.16(C)
NetR33_1: R33.1 U202.12(C)
NetR34_1: R34.1 U203.16(C)
NetR35_2: R35.2 U202.2(K)
NetR36_2: R36.2 U202.6(K)
NetR37_2: R37.2 U203.2(K)
NetR38_1: R38.1 R41.2 U16.4(G1)
NetR39_1: R39.1 R42.2 U17.4(G1)
NetR40_1: R40.1 R43.2 U18.4(G1)
NetR41_1: R41.1 U202.14(C)
NetR42_1: R42.1 U202.10(C)
NetR43_1: R43.1 U203.14(C)
NetR44_2: R44.2 U202.4(K)
NetR45_2: R45.2 U202.8(K)
NetR46_2: R46.2 U203.4(K)
NetR47_1: R47.1 R50.2 U31.2(G2)
NetR48_1: R48.1 R51.2 U32.2(G2)
NetR49_1: R49.1 R52.2 U33.2(G2)
NetR50_1: R50.1 U203.12(C)
NetR51_1: R51.1 U204.16(C)
NetR52_1: R52.1 U204.12(C)
NetR53_2: R53.2 U203.6(K)
NetR54_2: R54.2 U204.2(K)
NetR55_2: R55.2 U204.6(K)
NetR56_1: R56.1 R59.2 U31.4(G1)
NetR57_1: R57.1 R60.2 U32.4(G1)
NetR58_1: R58.1 R61.2 U33.4(G1)
NetR59_1: R59.1 U203.10(C)
NetR60_1: R60.1 U204.14(C)
NetR61_1: R61.1 U204.10(C)
NetR62_2: R62.2 U203.8(K)
NetR63_2: R63.2 U204.4(K)
NetR64_2: R64.2 U204.8(K)
NetR65_1: R65.1 R68.2 U46.2(G2)
NetR66_1: R66.1 R69.2 U47.2(G2)
NetR67_1: R67.1 R70.2 U48.2(G2)
NetR68_1: R68.1 U205.16(C)
NetR69_1: R69.1 U205.12(C)
NetR70_1: R70.1 U207.16(C)
NetR71_2: R71.2 U205.2(K)
NetR72_2: R72.2 U205.6(K)
NetR73_2: R73.2 U207.2(K)
NetR74_1: R74.1 R77.2 U46.4(G1)
NetR75_1: R75.1 R78.2 U47.4(G1)
NetR76_1: R76.1 R79.2 U48.4(G1)
NetR77_1: R77.1 U205.14(C)
NetR78_1: R78.1 U205.10(C)
NetR79_1: R79.1 U207.14(C)
NetR80_2: R80.2 U205.4(K)
NetR81_2: R81.2 U205.8(K)
NetR82_2: R82.2 U207.4(K)
NetR83_1: R83.1 R86.2 U61.2(G2)
NetR84_1: R84.1 R87.2 U62.2(G2)
NetR85_1: R85.1 R88.2 U63.2(G2)
NetR86_1: R86.1 U207.12(C)
NetR87_1: R87.1 U206.16(C)
NetR88_1: R88.1 U206.12(C)
NetR89_2: R89.2 U207.6(K)
NetR90_2: R90.2 U206.2(K)
NetR91_2: R91.2 U206.6(K)
NetR92_1: R92.1 R95.2 U61.4(G1)
NetR93_1: R93.1 R96.2 U62.4(G1)
NetR94_1: R94.1 R97.2 U63.4(G1)
NetR95_1: R95.1 U207.10(C)
NetR96_1: R96.1 U206.14(C)
NetR97_1: R97.1 U206.10(C)
NetR98_2: R98.2 U207.8(K)
NetR99_2: R99.2 U206.4(K)
NetR100_2: R100.2 U206.8(K)
NetR101_1: R101.1 R103.2 U74.2(G2)
NetR102_1: R102.1 R104.2 U75.2(G2)
NetR103_1: R103.1 U201.16(C)
NetR104_1: R104.1 U201.12(C)
NetR105_2: R105.2 U201.2(K)
NetR106_2: R106.2 U201.6(K)
NetR107_1: R107.1 R109.2 U74.4(G1)
NetR108_1: R108.1 R110.2 U75.4(G1)
NetR109_1: R109.1 U201.14(C)
NetR110_1: R110.1 U201.10(C)
NetR111_2: R111.2 U201.4(K)
NetR112_2: R112.2 U201.8(K)

### Library data of the parts
D9-D36 = D
P1-P28 = Header 4: Header, 4-Pin; LatestRevisionDate: 17-Jul-2002; LatestRevisionNote: Re-released for DXP Platform.; Publisher: Altium Limited
R29-R112 = 0603 2.7KΩ (2701) 1%: 贴片电阻; ComponentLink1Description: 供应商链接; ComponentLink1URL: http://www.szlcsc.com/product/details_13814.html; Package: 0603; Supplier: LC; SuppliersPartNumber: C13167
U16-U18 U31-U33 U46-U48 U61-U63 U74 U75 = NDS8434
U201-U207 = TP521-4_1

## Sheet 04_Power.SchDoc
size A4
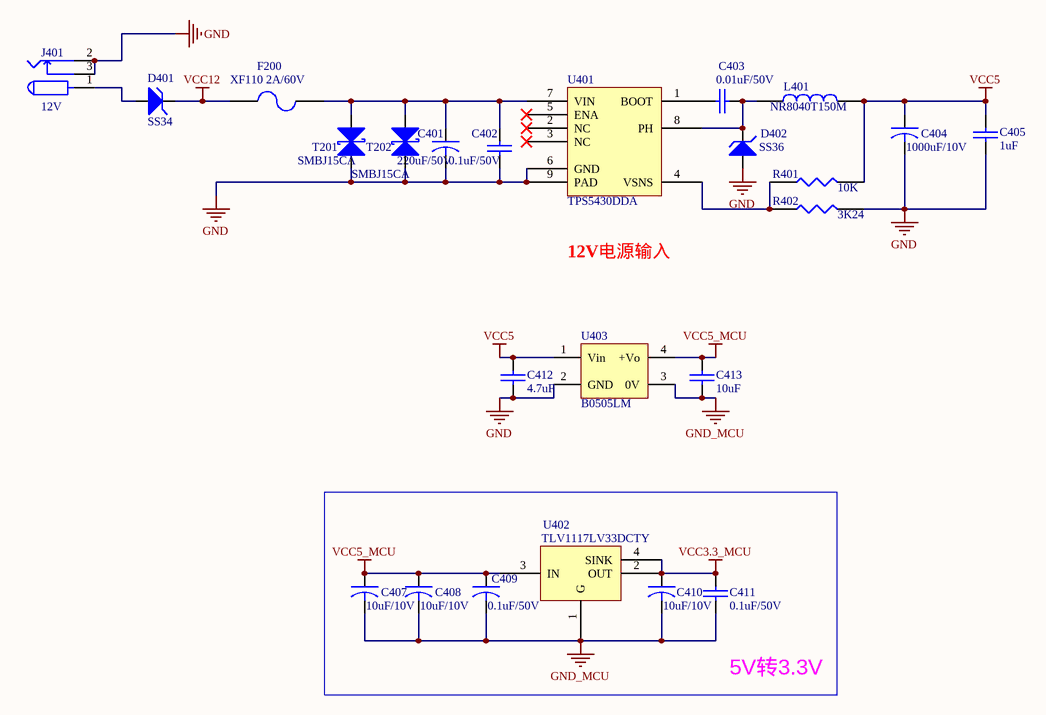
[diagram p4: 04_Power.SchDoc]

### Parts
C401  220uF/50V  [RB050-100]
C402  0.1uF/50V  [0805C]
C403  0.01uF/50V  [0603C]
C404  1000uF/10V  [RB035-080]
C405  1uF  [0603C]
C407  10uF/10V  [0805C]
C408  10uF/10V  [0603C]
C409  0.1uF/50V  [0805C]
C410  10uF/10V  [0805C]
C411  0.1uF/50V  [0603C]
C412  4.7uF  [0603C]
C413  10uF  [0603C]
D401  SS34  [D1812]
D402  SS36  [D1812]
F200  XF110 2A/60V  [FUSE1]
J401  12V  [DC10B]
L401  NR8040T150M  [NR8040]
R401  10K  [0603R]
R402  3K24  [0603R]
T201  SMBJ15CA  [SMBJ]
T202  SMBJ15CA  [SMBJ]
U401  TPS5430DDA  [SO-G8]
U402  TLV1117LV33DCTY  [SOT-233]
U403  B0505LM  [B0505LM]

### Blocks framed on the sheet
5V转3.3V: C407-C411 U402

### Nets
GND: C401.2 C402.2 C404.2 C405.1 C412.2 D402.1(A) J401.2 J401.3 R402.2 T201.2(K) T202.2(K) U401.6(GND) U401.9(PAD) U403.2(GND)
GND_MCU: C407.2 C408.2 C409.2 C410.2 C411.2 C413.1 U402.1(G) U403.3(0V)
VCC3.3_MCU: C410.1 C411.1 U402.2(OUT) U402.4(SINK)
VCC5: C404.1 C405.2 C412.1 L401.2 R401.2 U403.1(Vin)
VCC5_MCU: C407.1 C408.1 C409.1 C413.2 U402.3(IN) U403.4(+Vo)
VCC12: D401.2(K) F200.1
NetC401_1: C401.1 C402.1 F200.2 T201.1(A) T202.1(A) U401.7(VIN)
NetC403_1: C403.1 U401.1(BOOT)
NetC403_2: C403.2 D402.2(K) L401.1 U401.8(PH)
NetD401_1: D401.1(A) J401.1
NetR401_1: R401.1 R402.1 U401.4(VSNS)

Not connected (* = marked no-connect by the designer): U401 2(NC)* 3(NC)* 5(ENA)*

### Notes on the sheet
- 12V电源输入

### Library data of the parts
C401 C404 C407-C410 = CAPACITOR
C402 C403 = CAP: Capacitor
C405 C412 C413 = 0805C: Capacitor 0805
C411 = CAP
D401 = 1N5822: Zener Diode
D402 = SS36: Zener Diode
F200 = FUSE2: Fuse
J401 = POW
L401 = INDUCTOR
R401 R402 = RES1
T201 T202 = TVS
U402 = LM1117
U403 = B0505LM: DC/DC隔离电源（Mornsun）

## Sheet 05_FEED.SchDoc
size A4
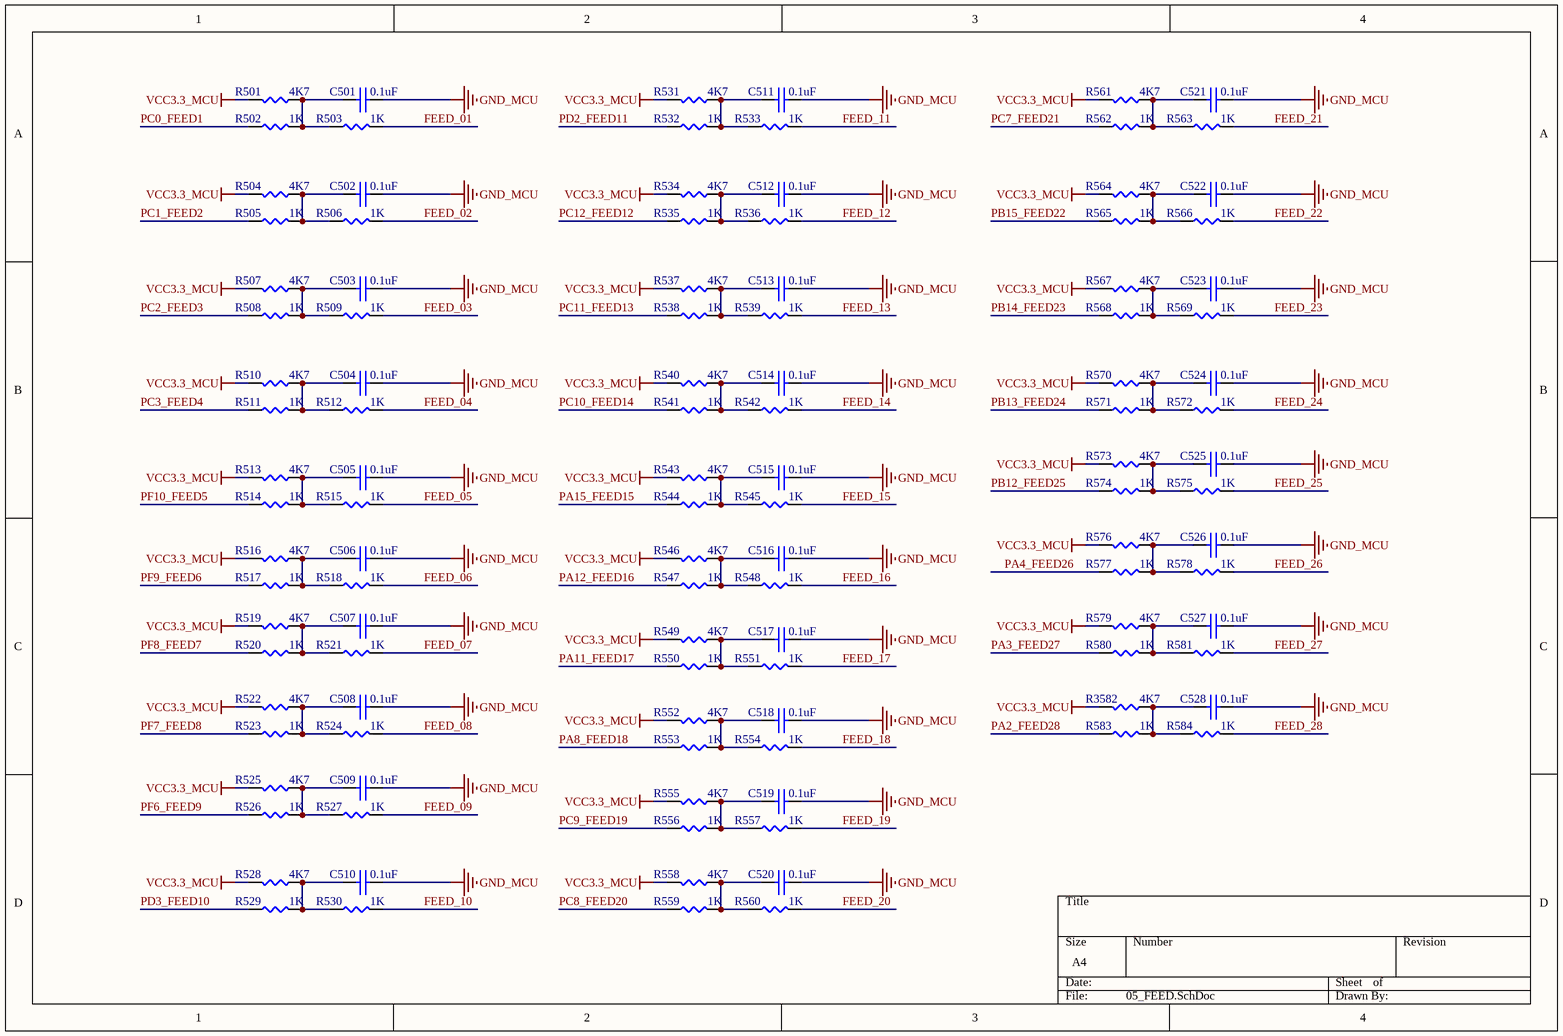
[diagram p5: 05_FEED.SchDoc]

### Parts
C501  0.1uF  [0603C]
C502  0.1uF  [0603C]
C503  0.1uF  [0603C]
C504  0.1uF  [0603C]
C505  0.1uF  [0603C]
C506  0.1uF  [0603C]
C507  0.1uF  [0603C]
C508  0.1uF  [0603C]
C509  0.1uF  [0603C]
C510  0.1uF  [0603C]
C511  0.1uF  [0603C]
C512  0.1uF  [0603C]
C513  0.1uF  [0603C]
C514  0.1uF  [0603C]
C515  0.1uF  [0603C]
C516  0.1uF  [0603C]
C517  0.1uF  [0603C]
C518  0.1uF  [0603C]
C519  0.1uF  [0603C]
C520  0.1uF  [0603C]
C521  0.1uF  [0603C]
C522  0.1uF  [0603C]
C523  0.1uF  [0603C]
C524  0.1uF  [0603C]
C525  0.1uF  [0603C]
C526  0.1uF  [0603C]
C527  0.1uF  [0603C]
C528  0.1uF  [0603C]
R501  4K7  [0603R]
R502  1K  [0603R]
R503  1K  [0603R]
R504  4K7  [0603R]
R505  1K  [0603R]
R506  1K  [0603R]
R507  4K7  [0603R]
R508  1K  [0603R]
R509  1K  [0603R]
R510  4K7  [0603R]
R511  1K  [0603R]
R512  1K  [0603R]
R513  4K7  [0603R]
R514  1K  [0603R]
R515  1K  [0603R]
R516  4K7  [0603R]
R517  1K  [0603R]
R518  1K  [0603R]
R519  4K7  [0603R]
R520  1K  [0603R]
R521  1K  [0603R]
R522  4K7  [0603R]
R523  1K  [0603R]
R524  1K  [0603R]
R525  4K7  [0603R]
R526  1K  [0603R]
R527  1K  [0603R]
R528  4K7  [0603R]
R529  1K  [0603R]
R530  1K  [0603R]
R531  4K7  [0603R]
R532  1K  [0603R]
R533  1K  [0603R]
R534  4K7  [0603R]
R535  1K  [0603R]
R536  1K  [0603R]
R537  4K7  [0603R]
R538  1K  [0603R]
R539  1K  [0603R]
R540  4K7  [0603R]
R541  1K  [0603R]
R542  1K  [0603R]
R543  4K7  [0603R]
R544  1K  [0603R]
R545  1K  [0603R]
R546  4K7  [0603R]
R547  1K  [0603R]
R548  1K  [0603R]
R549  4K7  [0603R]
R550  1K  [0603R]
R551  1K  [0603R]
R552  4K7  [0603R]
R553  1K  [0603R]
R554  1K  [0603R]
R555  4K7  [0603R]
R556  1K  [0603R]
R557  1K  [0603R]
R558  4K7  [0603R]
R559  1K  [0603R]
R560  1K  [0603R]
R561  4K7  [0603R]
R562  1K  [0603R]
R563  1K  [0603R]
R564  4K7  [0603R]
R565  1K  [0603R]
R566  1K  [0603R]
R567  4K7  [0603R]
R568  1K  [0603R]
R569  1K  [0603R]
R570  4K7  [0603R]
R571  1K  [0603R]
R572  1K  [0603R]
R573  4K7  [0603R]
R574  1K  [0603R]
R575  1K  [0603R]
R576  4K7  [0603R]
R577  1K  [0603R]
R578  1K  [0603R]
R579  4K7  [0603R]
R580  1K  [0603R]
R581  1K  [0603R]
R583  1K  [0603R]
R584  1K  [0603R]
R3582  4K7  [0603R]

### Nets
GND_MCU: C501.2 C502.2 C503.2 C504.2 C505.2 C506.2 C507.2 C508.2 C509.2 C510.2 C511.2 C512.2 C513.2 C514.2 C515.2 C516.2 C517.2 C518.2 C519.2 C520.2 C521.2 C522.2 C523.2 C524.2 C525.2 C526.2 C527.2 C528.2
VCC3.3_MCU: R501.2 R504.2 R507.2 R510.2 R513.2 R516.2 R519.2 R522.2 R525.2 R528.2 R531.2 R534.2 R537.2 R540.2 R543.2 R546.2 R549.2 R552.2 R555.2 R558.2 R561.2 R564.2 R567.2 R570.2 R573.2 R576.2 R579.2 R3582.2
FEED_01: R503.2
FEED_02: R506.2
FEED_03: R509.2
FEED_04: R512.2
FEED_05: R515.2
FEED_06: R518.2
FEED_07: R521.2
FEED_08: R524.2
FEED_09: R527.2
FEED_10: R530.2
FEED_11: R533.2
FEED_12: R536.2
FEED_13: R539.2
FEED_14: R542.2
FEED_15: R545.2
FEED_16: R548.2
FEED_17: R551.2
FEED_18: R554.2
FEED_19: R557.2
FEED_20: R560.2
FEED_21: R563.2
FEED_22: R566.2
FEED_23: R569.2
FEED_24: R572.2
FEED_25: R575.2
FEED_26: R578.2
FEED_27: R581.2
FEED_28: R584.2
PA2_FEED28: R583.1
PA3_FEED27: R580.1
PA4_FEED26: R577.1
PA8_FEED18: R553.1
PA11_FEED17: R550.1
PA12_FEED16: R547.1
PA15_FEED15: R544.1
PB12_FEED25: R574.1
PB13_FEED24: R571.1
PB14_FEED23: R568.1
PB15_FEED22: R565.1
PC0_FEED1: R502.1
PC1_FEED2: R505.1
PC2_FEED3: R508.1
PC3_FEED4: R511.1
PC7_FEED21: R562.1
PC8_FEED20: R559.1
PC9_FEED19: R556.1
PC10_FEED14: R541.1
PC11_FEED13: R538.1
PC12_FEED12: R535.1
PD2_FEED11: R532.1
PD3_FEED10: R529.1
PF6_FEED9: R526.1
PF7_FEED8: R523.1
PF8_FEED7: R520.1
PF9_FEED6: R517.1
PF10_FEED5: R514.1
NetC501_1: C501.1 R501.1 R502.2 R503.1
NetC502_1: C502.1 R504.1 R505.2 R506.1
NetC503_1: C503.1 R507.1 R508.2 R509.1
NetC504_1: C504.1 R510.1 R511.2 R512.1
NetC505_1: C505.1 R513.1 R514.2 R515.1
NetC506_1: C506.1 R516.1 R517.2 R518.1
NetC507_1: C507.1 R519.1 R520.2 R521.1
NetC508_1: C508.1 R522.1 R523.2 R524.1
NetC509_1: C509.1 R525.1 R526.2 R527.1
NetC510_1: C510.1 R528.1 R529.2 R530.1
NetC511_1: C511.1 R531.1 R532.2 R533.1
NetC512_1: C512.1 R534.1 R535.2 R536.1
NetC513_1: C513.1 R537.1 R538.2 R539.1
NetC514_1: C514.1 R540.1 R541.2 R542.1
NetC515_1: C515.1 R543.1 R544.2 R545.1
NetC516_1: C516.1 R546.1 R547.2 R548.1
NetC517_1: C517.1 R549.1 R550.2 R551.1
NetC518_1: C518.1 R552.1 R553.2 R554.1
NetC519_1: C519.1 R555.1 R556.2 R557.1
NetC520_1: C520.1 R558.1 R559.2 R560.1
NetC521_1: C521.1 R561.1 R562.2 R563.1
NetC522_1: C522.1 R564.1 R565.2 R566.1
NetC523_1: C523.1 R567.1 R568.2 R569.1
NetC524_1: C524.1 R570.1 R571.2 R572.1
NetC525_1: C525.1 R573.1 R574.2 R575.1
NetC526_1: C526.1 R576.1 R577.2 R578.1
NetC527_1: C527.1 R579.1 R580.2 R581.1
NetC528_1: C528.1 R583.2 R584.1 R3582.1

### Library data of the parts
C501-C528 = 0603C
R501-R581 R583 R584 R3582 = 0603R

## Sheet 06_GPRS.SchDoc
size A3
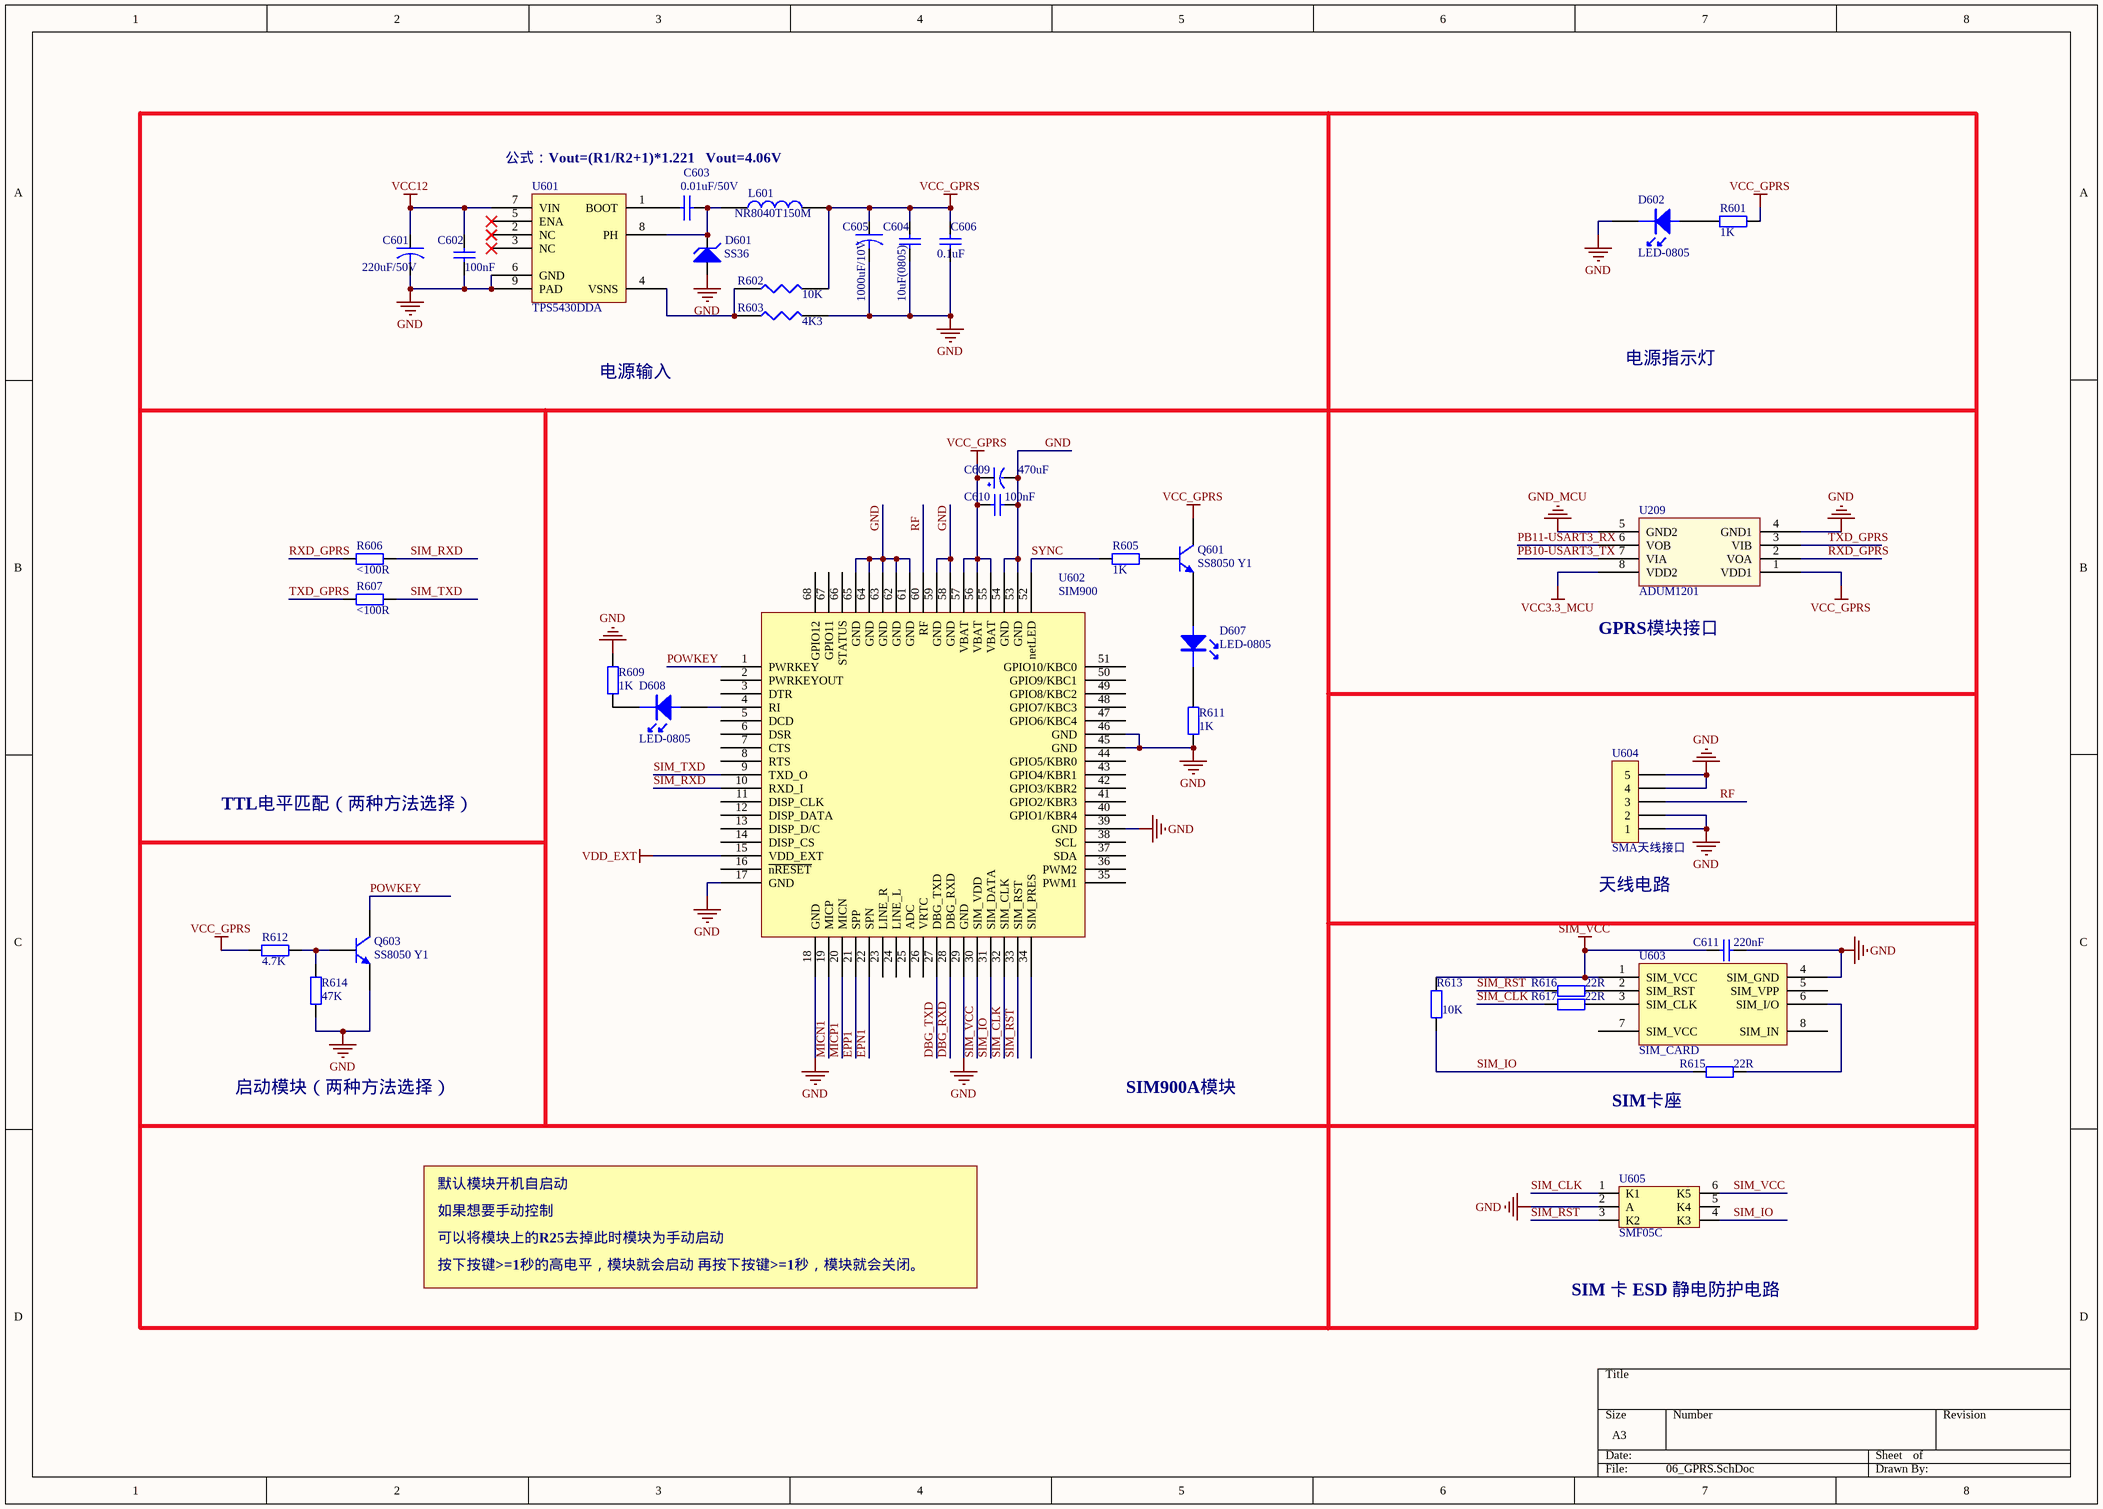
[diagram p6: 06_GPRS.SchDoc]

### Parts
C601  220uF/50V  [RB050-100]
C602  100nF  [0805C]
C603  0.01uF/50V  [0603C]
C604  10uF(0805)  [LC-0603_C]
C605  1000uF/10V  [RB035-080]
C606  0.1uF  [LC-0603_C]
C609  470uF  [CAP_10*10]
C610  100nF  [LC-0603_C]
C611  220nF  [LC-0603_C]
D601  SS36  [D1812]
D602  LED-0805  [0805LED]
D607  LED-0805  [0805LED]
D608  LED-0805  [0805LED]
L601  NR8040T150M  [NR8040]
Q601  SS8050 Y1  [LC-SOT-23(SOT-23-3)]
Q603  SS8050 Y1  [LC-SOT-23(SOT-23-3)]
R601  1K  [LC-0603_R]
R602  10K  [0603R]
R603  4K3  [0603R]
R605  1K  [LC-0603_R]
R606  <100R  [LC-0603_R]
R607  <100R  [LC-0603_R]
R609  1K  [LC-0603_R]
R611  1K  [LC-0603_R]
R612  4.7K  [LC-0603_R]
R613  10K  [LC-0603_R]
R614  47K  [LC-0603_R]
R615  22R  [LC-0603_R]
R616  22R  [LC-0603_R]
R617  22R  [LC-0603_R]
U209  ADUM1201  [SOP_8]
U601  TPS5430DDA  [SO-G8]
U602  SIM900  [GSM_900A]
U603  SIM_CARD  [MICRO SIM6]
U604  SMA天线接口  [RF_2]
U605  SMF05C  [SOT-363]

### Nets
GND: C601.2 C602.2 C604.2 C605.2 C606.1 C609.2(GND) C610.2 C611.2 D601.1(A) D602.1(-) Q603.2(E) R603.2 R609.2 R611.2 R614.1 U209.4(GND1) U601.6(GND) U601.9(PAD) U602.17(GND) U602.18(GND) U602.29(GND) U602.39(GND) U602.45(GND) U602.46(GND) U602.53(GND) U602.54(GND) U602.58(GND) U602.59(GND) U602.61(GND) U602.62(GND) U602.63(GND) U602.64(GND) U602.65(GND) U603.4(SIM_GND) U604.1 U604.2 U604.4 U604.5 U605.2(A)
GND_MCU: U209.5(GND2)
SIM_VCC: C611.1 R613.2 U602.30(SIM_VDD) U603.1(SIM_VCC) U605.6(K5)
VCC3.3_MCU: U209.8(VDD2)
VCC12: C601.1 C602.1 U601.7(VIN)
VCC_GPRS: C604.1 C605.1 C606.2 C609.1(VCC) C610.1 L601.2 Q601.3(C) R601.1 R602.2 R612.1 U209.1(VDD1) U602.55(VBAT) U602.56(VBAT) U602.57(VBAT)
VDD_EXT: U602.15(VDD_EXT)
DBG_RXD: U602.28(DBG_RXD)
DBG_TXD: U602.27(DBG_TXD)
EPN1: U602.22(SPN)
EPP1: U602.21(SPP)
MICN1: U602.19(MICP)
MICP1: U602.20(MICN)
PB10-USART3_TX: U209.7(VIA)
PB11-USART3_RX: U209.6(VOB)
POWKEY: Q603.3(C) U602.1(PWRKEY)
RF: U602.60(RF) U604.3
RXD_GPRS: R606.1 U209.2(VOA)
SIM_CLK: R617.2 U602.32(SIM_CLK) U605.1(K1)
SIM_IO: R613.1 R615.2 U602.31(SIM_DATA) U605.4(K3)
SIM_RST: R616.2 U602.33(SIM_RST) U605.3(K2)
SIM_RXD: R606.2 U602.10(RXD_I)
SIM_TXD: R607.2 U602.9(TXD_O)
SYNC: R605.2 U602.52(netLED)
TXD_GPRS: R607.1 U209.3(VIB)
NetC603_1: C603.1 U601.1(BOOT)
NetC603_2: C603.2 D601.2(K) L601.1 U601.8(PH)
NetD602_2: D602.2(+) R601.2
NetD607_1: D607.1(-) R611.1
NetD607_2: D607.2(+) Q601.2(E)
NetD608_1: D608.1(-) R609.1
NetD608_2: D608.2(+) U602.4(RI)
NetQ601_1: Q601.1(B) R605.1
NetQ603_1: Q603.1(B) R612.2 R614.2
NetR602_1: R602.1 R603.1 U601.4(VSNS)
NetR615_1: R615.1 U603.6(SIM_I/O)
NetR616_1: R616.1 U603.2(SIM_RST)
NetR617_1: R617.1 U603.3(SIM_CLK)

Not connected (* = marked no-connect by the designer): U601 2(NC)* 3(NC)* 5(ENA)*; U602 2(PWRKEYOUT) 3(DTR) 5(DCD) 6(DSR) 7(CTS) 8(RTS) 11(DISP_CLK) 12(DISP_DATA) 13(DISP_D/C) 14(DISP_CS) 16(~{nRESET}) 23(LINE_R) 24(LINE_L) 25(ADC) 26(VRTC) 34(SIM_PRES) 35(PWM1) 36(PWM2) 37(SDA) 38(SCL) 40(GPIO1/KBR4) 41(GPIO2/KBR3) 42(GPIO3/KBR2) 43(GPIO4/KBR1) 44(GPIO5/KBR0) 47(GPIO6/KBC4) 48(GPIO7/KBC3) 49(GPIO8/KBC2) 50(GPIO9/KBC1) 51(GPIO10/KBC0) 66(STATUS) 67(GPIO11) 68(GPIO12); U603 5(SIM_VPP) 7(SIM_VCC) 8(SIM_IN); U605 5(K4)

### Notes on the sheet
- 公式：Vout=(R1/R2+1)*1.221   Vout=4.06V
- 电源输入
- 电源指示灯
- (near U209) GPRS模块接口
- TTL电平匹配（两种方法选择）
- (near U604) 天线电路
- 启动模块（两种方法选择）
- SIM900A模块
- SIM卡座
- 默认模块开机自启动
- 如果想要手动控制
- 可以将模块上的R25去掉此时模块为手动启动
- 按下按键>=1秒的高电平，模块就会启动 再按下按键>=1秒，模块就会关闭。
- SIM 卡 ESD 静电防护电路

### Library data of the parts
C601 C605 = CAPACITOR
C602 C604 C610 C611 = 0603 1uF (105) 10% 50V: 贴片电容; ComponentLink1Description: 供应商链接; ComponentLink1URL: http://www.szlcsc.com/product/details_16531.html; Package: 0603; Supplier: LC; SuppliersPartNumber: C15849
C603 = CAP: Capacitor
C606 = 0603 1.0pF (010) 0.25pF 50V: 贴片电容; ComponentLink1Description: 供应商链接; ComponentLink1URL: http://www.szlcsc.com/product/details_24709.html; Package: 0603; Supplier: LC; SuppliersPartNumber: C23969
C609 = CAP
D601 = SS36: Zener Diode
D602 D607 D608 = LED_SMD: 贴片LED
L601 = INDUCTOR
Q601 Q603 = SOT-23 SS8050 Y1: 三极管; ComponentLink1Description: 供应商链接; ComponentLink1URL: http://www.szlcsc.com/product/details_2507.html; Package: SOT-23; Supplier: LC; SuppliersPartNumber: C2150
R601 R605-R607 R609 R611-R617 = 0603 2KΩ (2001) 1%: 贴片电阻; ComponentLink1Description: 供应商链接; ComponentLink1URL: http://www.szlcsc.com/product/details_23702.html; Package: 0603; Supplier: LC; SuppliersPartNumber: C22975
R602 R603 = RES1
U209 = ADUM1201: 串口隔离
U603 = SIM_CARD: SIM中卡卡槽
U604 = CON5: Connector
U605 = SMF05C: TVS

## Nets that join several sheets
GND: 02_MISC (14 pins), 03_DO (84 pins), 04_Power (14 pins), 06_GPRS (39 pins)
GND_MCU: 01_MCU (35 pins), 02_MISC (7 pins), 03_DO (28 pins), 04_Power (8 pins), 05_FEED (28 pins), 06_GPRS (U209.5)
VCC3.3_MCU: 01_MCU (5 pins), 02_MISC (9 pins), 03_DO (28 pins), 04_Power (C410.1 C411.1 U402.2 U402.4), 05_FEED (28 pins), 06_GPRS (U209.8)
VCC5: 02_MISC (6 pins), 04_Power (6 pins)
VCC12: 02_MISC (8 pins), 03_DO (56 pins), 04_Power (D401.2 F200.1), 06_GPRS (C601.1 C602.1 U601.7)
FEED_01: 03_DO (P1.3), 05_FEED (R503.2)
FEED_02: 03_DO (P2.3), 05_FEED (R506.2)
FEED_03: 03_DO (P3.3), 05_FEED (R509.2)
FEED_04: 03_DO (P4.3), 05_FEED (R512.2)
FEED_05: 03_DO (P5.3), 05_FEED (R515.2)
FEED_06: 03_DO (P6.3), 05_FEED (R518.2)
FEED_07: 03_DO (P7.3), 05_FEED (R521.2)
FEED_08: 03_DO (P8.3), 05_FEED (R524.2)
FEED_09: 03_DO (P9.3), 05_FEED (R527.2)
FEED_10: 03_DO (P10.3), 05_FEED (R530.2)
FEED_11: 03_DO (P11.3), 05_FEED (R533.2)
FEED_12: 03_DO (P12.3), 05_FEED (R536.2)
FEED_13: 03_DO (P13.3), 05_FEED (R539.2)
FEED_14: 03_DO (P14.3), 05_FEED (R542.2)
FEED_15: 03_DO (P15.3), 05_FEED (R545.2)
FEED_16: 03_DO (P16.3), 05_FEED (R548.2)
FEED_17: 03_DO (P17.3), 05_FEED (R551.2)
FEED_18: 03_DO (P18.3), 05_FEED (R554.2)
FEED_19: 03_DO (P19.3), 05_FEED (R557.2)
FEED_20: 03_DO (P20.3), 05_FEED (R560.2)
FEED_21: 03_DO (P21.3), 05_FEED (R563.2)
FEED_22: 03_DO (P22.3), 05_FEED (R566.2)
FEED_23: 03_DO (P23.3), 05_FEED (R569.2)
FEED_24: 03_DO (P24.3), 05_FEED (R572.2)
FEED_25: 03_DO (P25.3), 05_FEED (R575.2)
FEED_26: 03_DO (P26.3), 05_FEED (R578.2)
FEED_27: 03_DO (P27.3), 05_FEED (R581.2)
FEED_28: 03_DO (P28.3), 05_FEED (R584.2)
PA2_FEED28: 01_MCU (U101.36), 05_FEED (R583.1)
PA3_FEED27: 01_MCU (U101.37), 05_FEED (R580.1)
PA4_FEED26: 01_MCU (U101.40), 05_FEED (R577.1)
PA5_CH28: 01_MCU (U101.41), 03_DO (R100.1)
PA6_CH27: 01_MCU (U101.42), 03_DO (R91.1)
PA7_CH26: 01_MCU (U101.43), 03_DO (R99.1)
PA8_FEED18: 01_MCU (U101.100), 05_FEED (R553.1)
PA9-USART1_TX: 01_MCU (U101.101), 02_MISC (P209.2 U210.7)
PA10-USART1_RX: 01_MCU (U101.102), 02_MISC (P209.3 U210.6)
PA11_FEED17: 01_MCU (U101.103), 05_FEED (R550.1)
PA12_FEED16: 01_MCU (U101.104), 05_FEED (R547.1)
PA15_FEED15: 01_MCU (U101.110), 05_FEED (R544.1)
PB0_CH23: 01_MCU (U101.46), 03_DO (R89.1)
PB1_CH22: 01_MCU (U101.47), 03_DO (R82.1)
PB3_CH9: 01_MCU (U101.133), 03_DO (R37.1)
PB4_CH8: 01_MCU (U101.134), 03_DO (R45.1)
PB5_CH7: 01_MCU (U101.135), 03_DO (R36.1)
PB6_CH6: 01_MCU (U101.136), 03_DO (R44.1)
PB7_CH5: 01_MCU (U101.137), 03_DO (R35.1)
PB8_CH4: 01_MCU (U101.139), 03_DO (R112.1)
PB9_CH3: 01_MCU (U101.140), 03_DO (R106.1)
PB10-USART3_TX: 01_MCU (U101.69), 02_MISC (P211.3), 06_GPRS (U209.7)
PB11-USART3_RX: 01_MCU (U101.70), 02_MISC (P211.2), 06_GPRS (U209.6)
PB12_FEED25: 01_MCU (U101.73), 05_FEED (R574.1)
PB13_FEED24: 01_MCU (U101.74), 05_FEED (R571.1)
PB14_FEED23: 01_MCU (U101.75), 05_FEED (R568.1)
PB15_FEED22: 01_MCU (U101.76), 05_FEED (R565.1)
PC0_FEED1: 01_MCU (U101.26), 05_FEED (R502.1)
PC1_FEED2: 01_MCU (U101.27), 05_FEED (R505.1)
PC2_FEED3: 01_MCU (U101.28), 05_FEED (R508.1)
PC3_FEED4: 01_MCU (U101.29), 05_FEED (R511.1)
PC4_CH25: 01_MCU (U101.44), 03_DO (R90.1)
PC5_CH24: 01_MCU (U101.45), 03_DO (R98.1)
PC6_CH18: 01_MCU (U101.96), 03_DO (R80.1)
PC7_FEED21: 01_MCU (U101.97), 05_FEED (R562.1)
PC8_FEED20: 01_MCU (U101.98), 05_FEED (R559.1)
PC9_FEED19: 01_MCU (U101.99), 05_FEED (R556.1)
PC10_FEED14: 01_MCU (U101.111), 05_FEED (R541.1)
PC11_FEED13: 01_MCU (U101.112), 05_FEED (R538.1)
PC12_FEED12: 01_MCU (U101.113), 05_FEED (R535.1)
PC13_HW_SW1: 01_MCU (U101.7), 02_MISC (R114.2 U208.14)
PD2_FEED11: 01_MCU (U101.116), 05_FEED (R532.1)
PD3_FEED10: 01_MCU (U101.117), 05_FEED (R529.1)
PD6_CH17: 01_MCU (U101.122), 03_DO (R71.1)
PD7_CH16: 01_MCU (U101.123), 03_DO (R64.1)
PE2_CH2: 01_MCU (U101.1), 03_DO (R111.1)
PE3_CH1: 01_MCU (U101.2), 03_DO (R105.1)
PE4_JDQ2: 01_MCU (U101.4), 02_MISC (R22.1)
PE5_JDQ1: 01_MCU (U101.3), 02_MISC (R25.1)
PE6_HW_SW2: 01_MCU (U101.5), 02_MISC (R116.2 U208.16)
PF6_FEED9: 01_MCU (U101.18), 05_FEED (R526.1)
PF7_FEED8: 01_MCU (U101.19), 05_FEED (R523.1)
PF8_FEED7: 01_MCU (U101.20), 05_FEED (R520.1)
PF9_FEED6: 01_MCU (U101.21), 05_FEED (R517.1)
PF10_FEED5: 01_MCU (U101.22), 05_FEED (R514.1)
PG6_CH21: 01_MCU (U101.91), 03_DO (R73.1)
PG7_CH20: 01_MCU (U101.92), 03_DO (R81.1)
PG8_CH19: 01_MCU (U101.93), 03_DO (R72.1)
PG9_CH15: 01_MCU (U101.124), 03_DO (R55.1)
PG11_CH14: 01_MCU (U101.126), 03_DO (R63.1)
PG12_CH13: 01_MCU (U101.127), 03_DO (R54.1)
PG13_CH12: 01_MCU (U101.128), 03_DO (R62.1)
PG14_CH11: 01_MCU (U101.129), 03_DO (R53.1)
PG15_CH10: 01_MCU (U101.132), 03_DO (R46.1)